# EAGLE board EEZ DIB DCP405 r4B2 (EAGLE 7.2.0), part 1 of 2
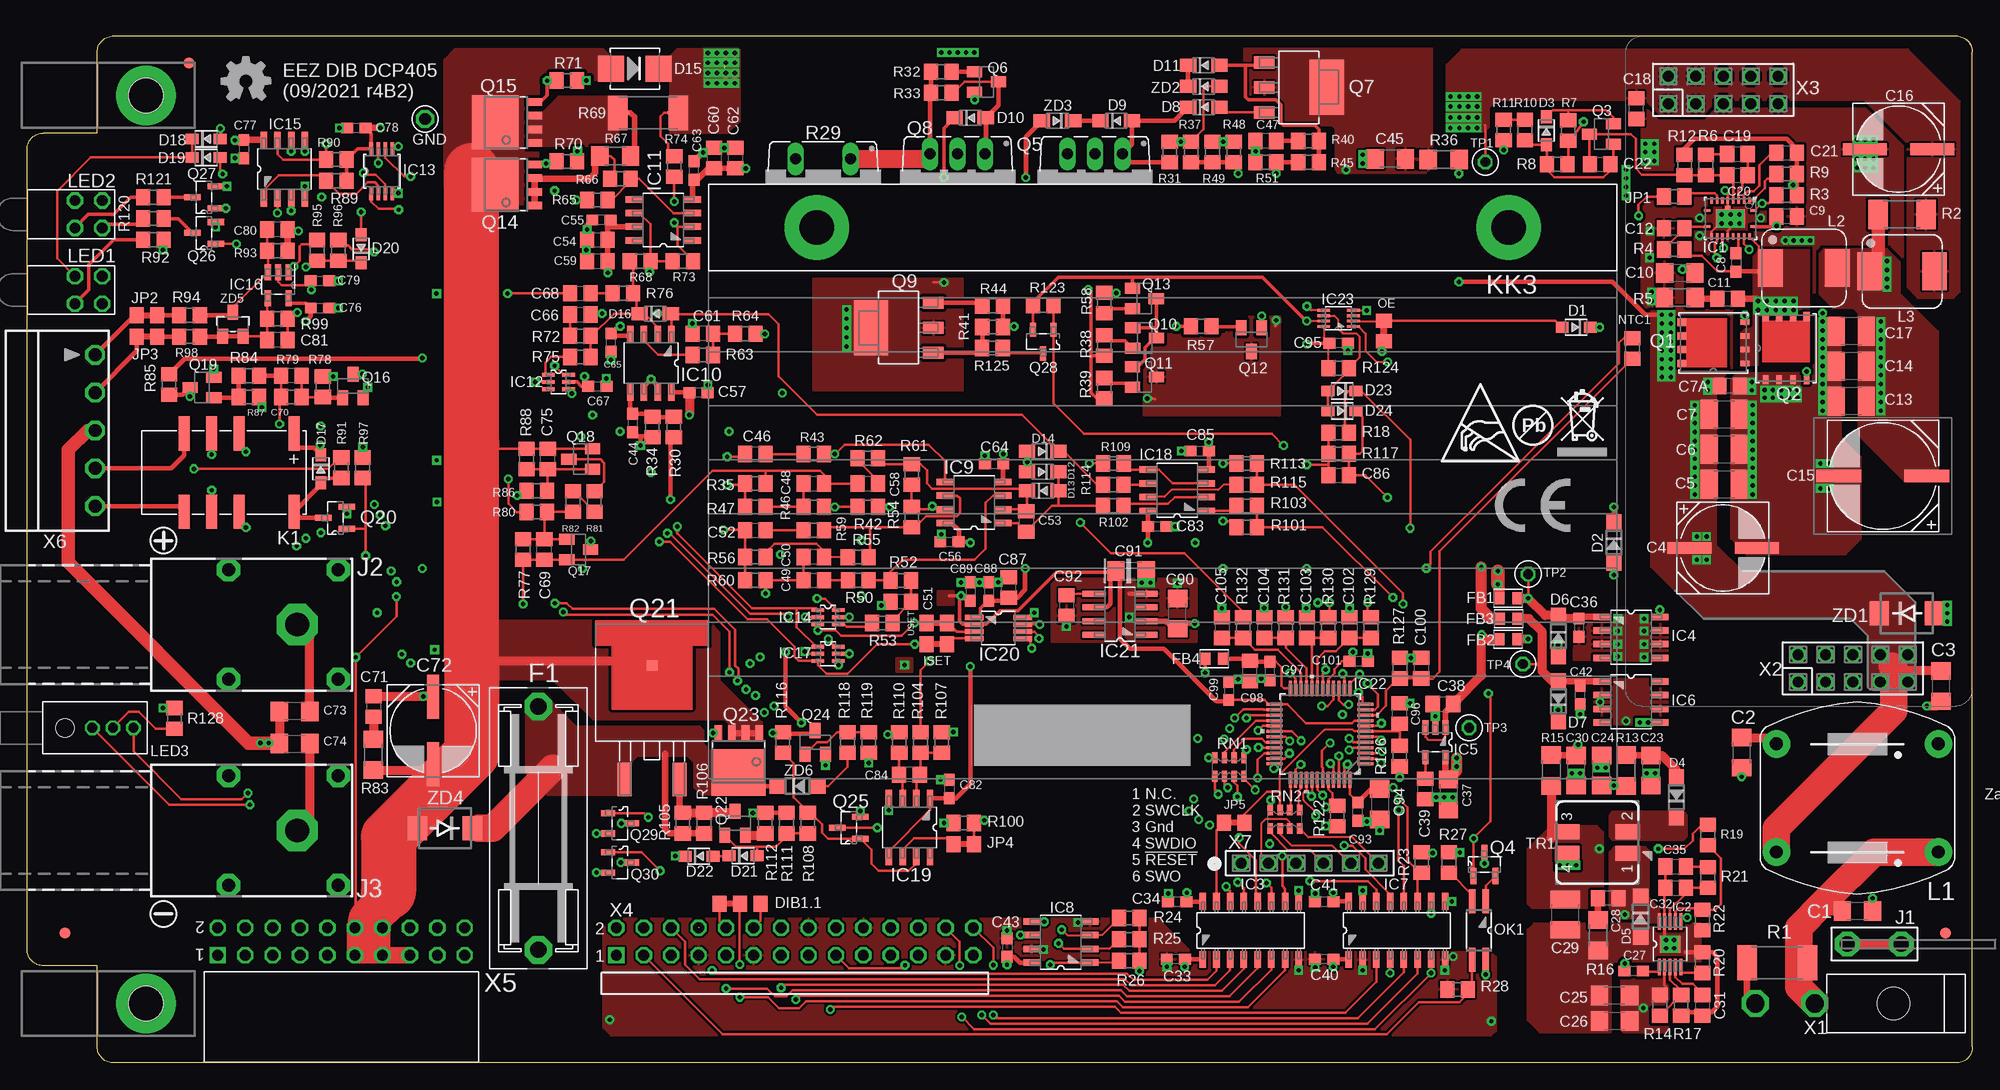
[diagram p6: board, top side]
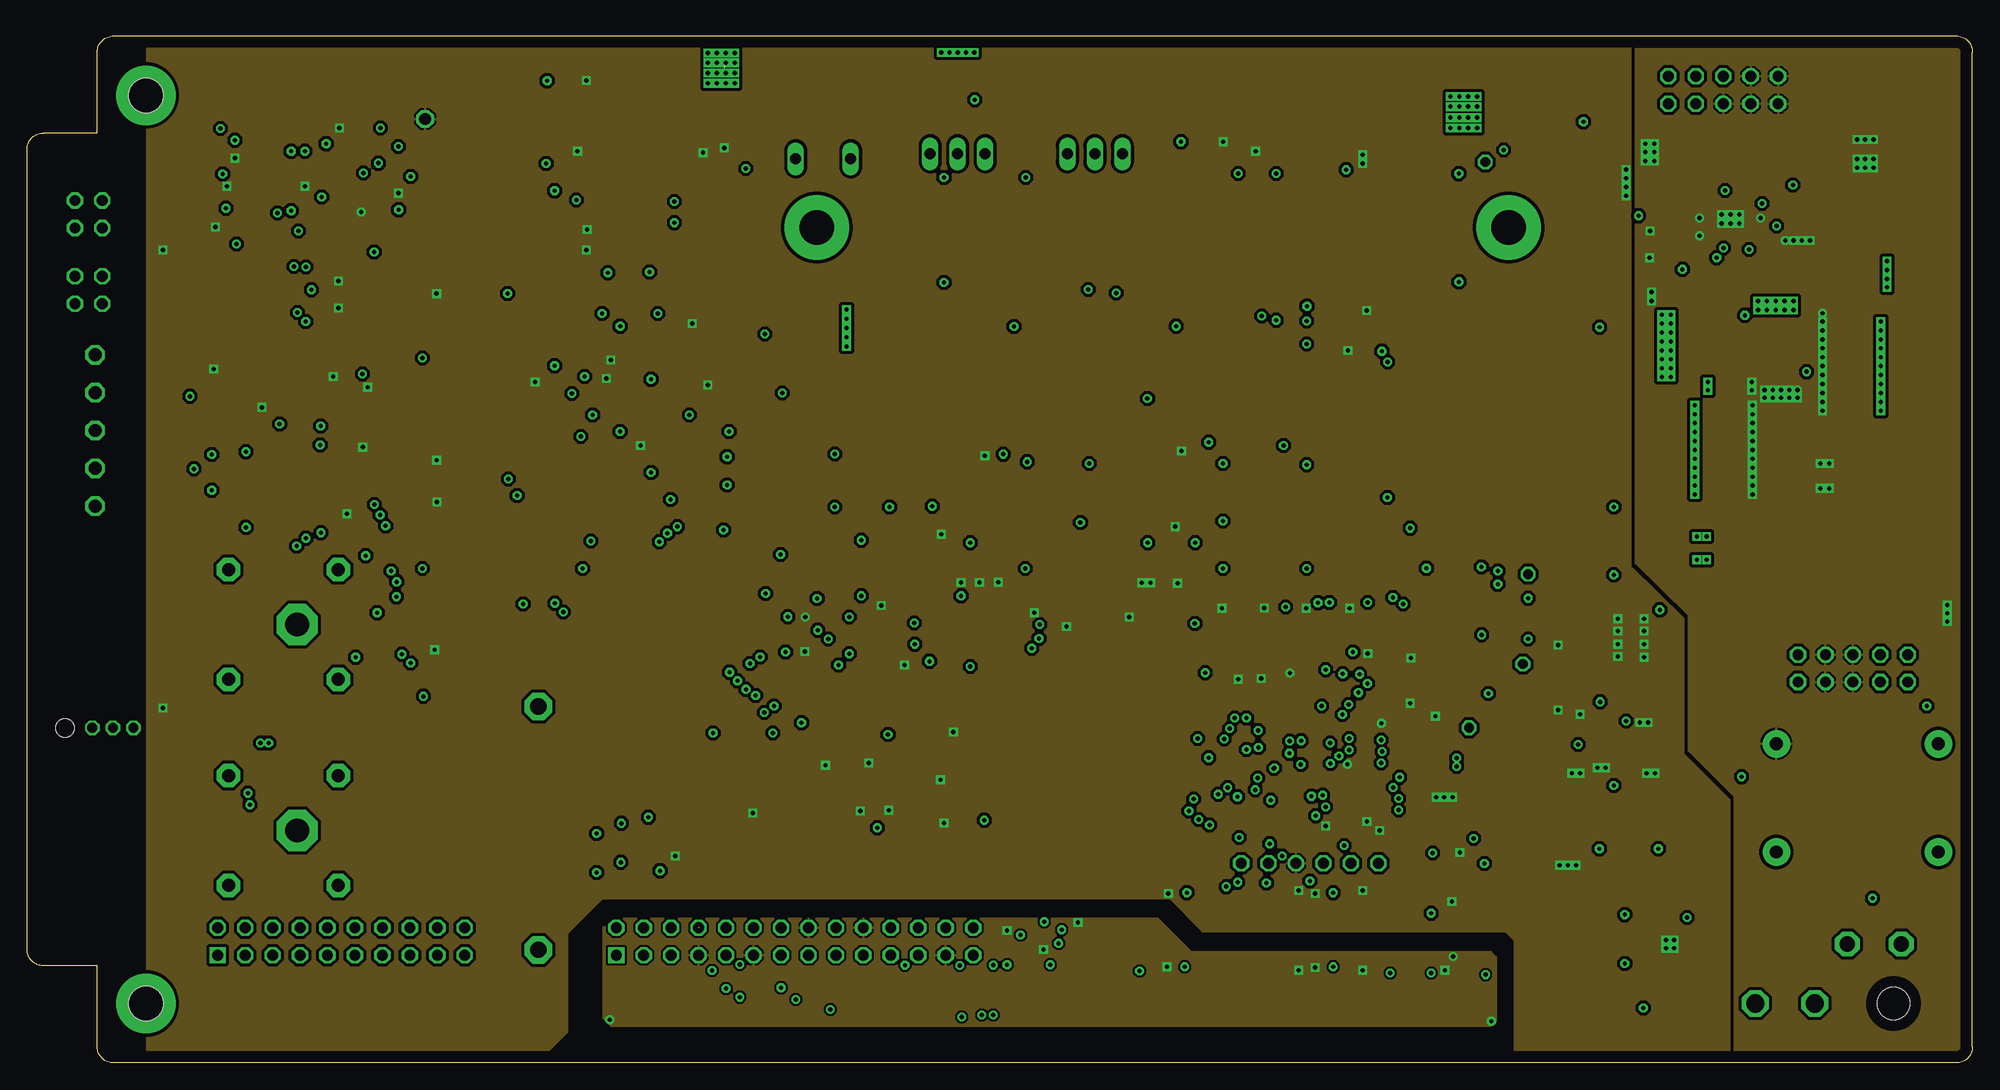
[diagram p7: board, inner layer L2]
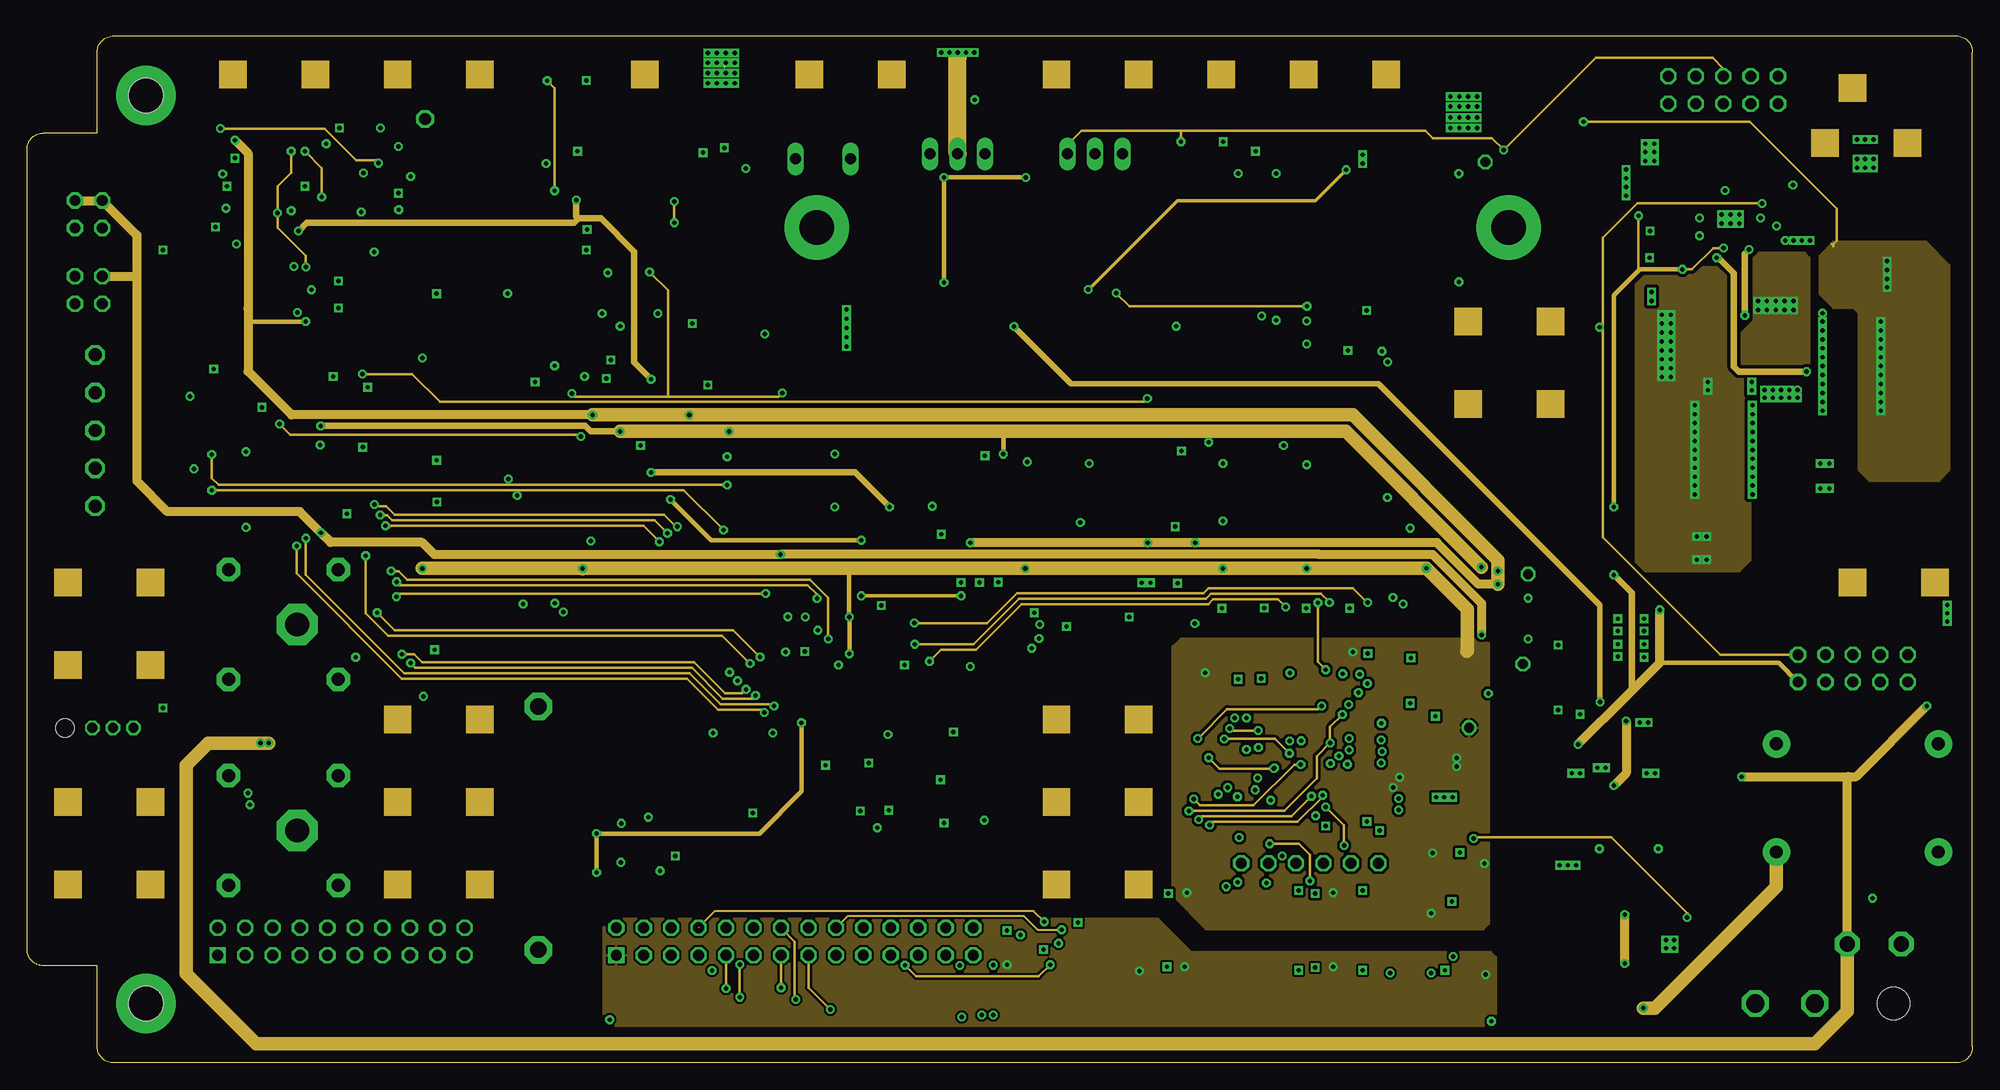
[diagram p8: board, inner layer L3]
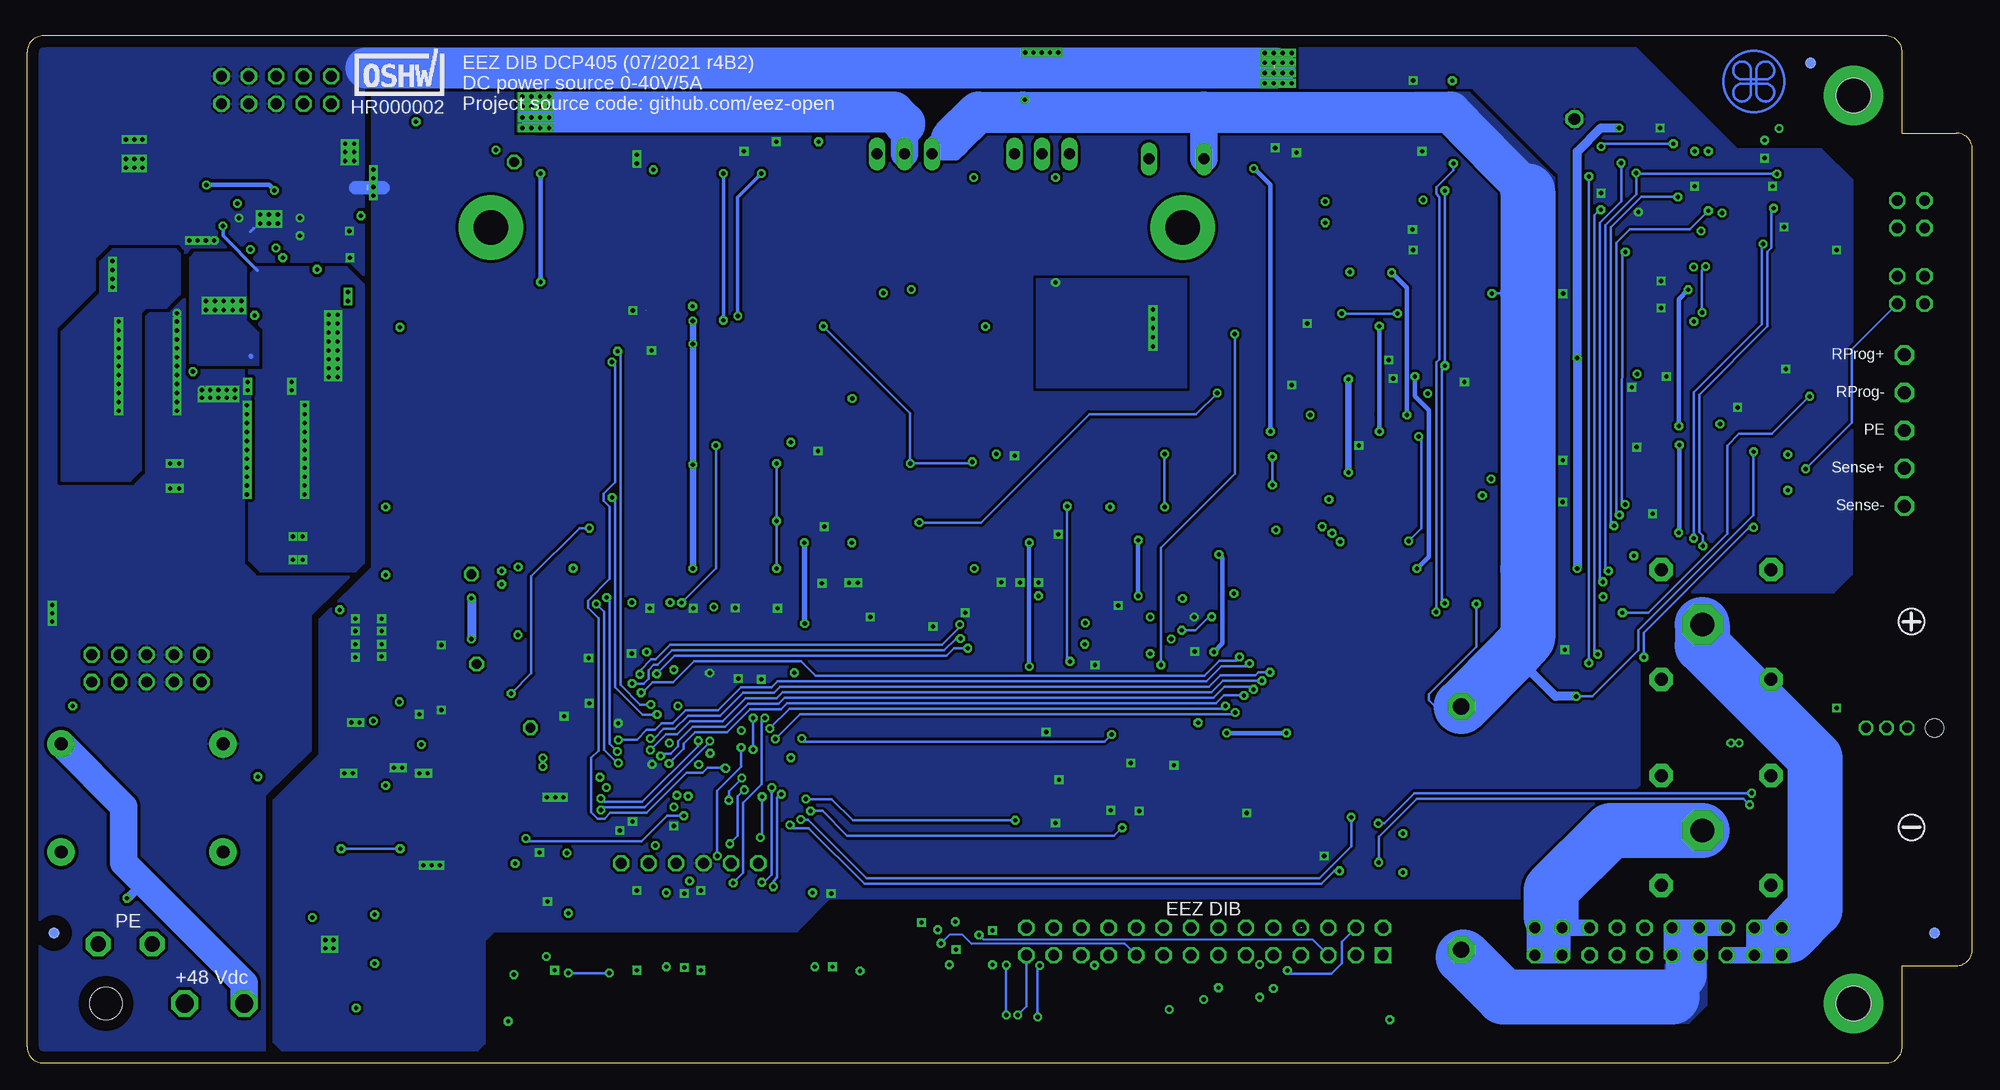
[diagram p9: board, bottom side, seen from below]

Size 180 x 95 mm. Coordinates in mm from the lower left corner, seen from the top.
Outline: 8,95 178.5,95 arc-90 180,93.5 180,1.5 arc-90 178.5,0 8,0 arc-90 6.5,1.5 6.5,9 1.5,9 arc-90 0,10.5 0,84.5 arc-90 1.5,86 6.5,86 6.5,93.5 arc-90 8,95
Copper layers (1+2+15+16): Top 0.035mm / dielectric 7mil / L2 0.03mm / dielectric 44mil / L3 0.03mm / dielectric 7mil / Bottom 0.035mm
Design rules "default *": minimum track width 6mil, minimum drill 0.3mm, track to track 6mil, track to pad 6mil, pad to pad 6mil, via to via 6mil, smd to smd 6mil, copper to edge 40mil, drill to drill 8mil, minimum pad ring 4mil, minimum via ring 8mil, stop-mask expansion 2.5mil, vias tented up to drill 1mm, thermal gap 8mil
Net classes: 0 default: width 0.203 mm, drill 0.3 mm, clearance 0.203 mm; 1 lvds: width 0.152 mm, drill 0.3 mm, clearance 0.152 mm to class 0, clearance 0.152 mm; 2 gnd: width 0.254 mm, drill 0.584 mm, clearance 0.254 mm
vRestrict: area 53,0 to 128,8.5; area 0,0 to 42,14

## Footprints (pad centres in the part's own frame; a part is rotated, then mirrored left to right if it is on the bottom)
C1206 = smd 1.6 x 1.8: 1 -1.4,0; 2 1.4,0
CAPAE830X1050N = smd 4.064 x 1.092: + -3.124,0; - 3.124,0
C1210 = smd 1.6 x 2.7: 1 -1.4,0; 2 1.4,0
C0805 = smd 1.3 x 1.5: 1 -0.95,0; 2 0.95,0
C0603 = smd 1.1 x 1: 1 -0.85,0; 2 0.85,0
CAPAE1030X1050N = smd 4.166 x 1.194: + -4.064,0; - 4.064,0
EC1206 = smd 1.6 x 1.8: + -1.4,0; - 1.4,0
SOD323-R = smd 1.2 x 1: A 1.3,0; C -1.3,0
SOD123 = smd 1.4 x 1.4: A 1.9,0; C -1.9,0
SOD323-W = smd 1.5 x 1.2: A 1.45,0; C -1.45,0
SMB = smd 2.4 x 2.4: A 2.2,0; C -2.2,0
JP3-0805-CUT2 = smd 1.3 x 1.5: COM 0,0; NC 1.9,0; NO -1.9,0
ZH32 = drill 1.5 pad 2.54 octagon: 1 -11.25,0; 2 11.25,0
BEAD0603 = smd 1 x 1.1: P$1 -0.85,0; P$2 0.85,0
FIDUCIAL_DUAL = smd 1.016 x 1.016 bottom: B 0,0 | smd 1.016 x 1.016: T 0,0
PCB_SHIELD_TAB = drill 1.1 octagon: 1 0,0
RGY0020B = smd 0.24 x 0.6: 1 -0.75,2.15; 10 -0.75,-2.15; 11 0.75,-2.15; 20 0.75,2.15 | smd 0.6 x 0.24: 2 -1.65,1.75; 3 -1.65,1.25; 4 -1.65,0.75; 5 -1.65,0.25; 6 -1.65,-0.25; 7 -1.65,-0.75; 8 -1.65,-1.25; 9 -1.65,-1.75; 12 1.65,-1.75; 13 1.65,-1.25; 14 1.65,-0.75; 15 1.65,-0.25; 16 1.65,0.25; 17 1.65,0.75; 18 1.65,1.25; 19 1.65,1.75 | smd 1.7 x 2.7: 21 0,0
SOP50P490X110-11N = smd 1.549 x 0.279: 1 -2.108,0.991; 2 -2.108,0.508; 3 -2.108,0; 4 -2.108,-0.508; 5 -2.108,-0.991; 6 2.108,-0.991; 7 2.108,-0.508; 8 2.108,0; 9 2.108,0.508; 10 2.108,0.991 | smd 1.575 x 1.88: TP 0,0
SOIC-16 = smd 1.549 x 0.61: 1 -2.692,4.445; 2 -2.692,3.175; 3 -2.692,1.905; 4 -2.692,0.635; 5 -2.692,-0.635; 6 -2.692,-1.905; 7 -2.692,-3.175; 8 -2.692,-4.445; 9 2.692,-4.445; 10 2.692,-3.175; 11 2.692,-1.905; 12 2.692,-0.635; 13 2.692,0.635; 14 2.692,1.905; 15 2.692,3.175; 16 2.692,4.445
SOIC127P600X173-8N = smd 1.55 x 0.6: 1 -2.7,1.9; 2 -2.7,0.63; 3 -2.7,-0.64; 4 -2.7,-1.91; 5 2.7,-1.91; 6 2.7,-0.64; 7 2.7,0.63; 8 2.7,1.9
SOT95P270X145-5N = smd 1.321 x 0.559: 1 -1.372,0.94; 2 -1.372,0; 3 -1.372,-0.94; 4 1.372,-0.94; 5 1.372,0.94
SOT65P210X110-6N = smd 1.168 x 0.356: 1 -0.94,0.66; 2 -0.94,0; 3 -0.94,-0.66; 4 0.94,-0.66; 5 0.94,0; 6 0.94,0.66
DCT8 = smd 1.232 x 0.356: 1 -2.064,0.975; 2 -2.064,0.325; 3 -2.064,-0.325; 4 -2.064,-0.975; 5 2.064,-0.975; 6 2.064,-0.325; 7 2.064,0.325; 8 2.064,0.975
DBV5 = smd 1.473 x 0.559: 1 -1.194,0.95; 2 -1.194,0; 3 -1.194,-0.95; 4 1.194,-0.95; 5 1.194,0.95
DGK8-M = smd 1.727 x 0.483: 1 -2.235,0.965; 2 -2.235,0.33; 3 -2.235,-0.33; 4 -2.235,-0.965; 5 2.235,-0.965; 6 2.235,-0.33; 7 2.235,0.33; 8 2.235,0.965
SOIC127P600X175-8N = smd 1.981 x 0.559: 1 -2.464,1.905; 2 -2.464,0.635; 3 -2.464,-0.635; 4 -2.464,-1.905; 5 2.464,-1.905; 6 2.464,-0.635; 7 2.464,0.635; 8 2.464,1.905
LQFP-48 = smd 1.473 x 0.279: 1 -4.216,2.743; 2 -4.216,2.261; 3 -4.216,1.753; 4 -4.216,1.245; 5 -4.216,0.762; 6 -4.216,0.254; 7 -4.216,-0.254; 8 -4.216,-0.762; 9 -4.216,-1.245; 10 -4.216,-1.753; 11 -4.216,-2.261; 12 -4.216,-2.743; 25 4.216,-2.743; 26 4.216,-2.261; 27 4.216,-1.753; 28 4.216,-1.245; 29 4.216,-0.762; 30 4.216,-0.254; 31 4.216,0.254; 32 4.216,0.762; 33 4.216,1.245; 34 4.216,1.753; 35 4.216,2.261; 36 4.216,2.743 | smd 0.279 x 1.473: 13 -2.743,-4.216; 14 -2.261,-4.216; 15 -1.753,-4.216; 16 -1.245,-4.216; 17 -0.762,-4.216; 18 -0.254,-4.216; 19 0.254,-4.216; 20 0.762,-4.216; 21 1.245,-4.216; 22 1.753,-4.216; 23 2.261,-4.216; 24 2.743,-4.216; 37 2.743,4.216; 38 2.261,4.216; 39 1.753,4.216; 40 1.245,4.216; 41 0.762,4.216; 42 0.254,4.216; 43 -0.254,4.216; 44 -0.762,4.216; 45 -1.245,4.216; 46 -1.753,4.216; 47 -2.261,4.216; 48 -2.743,4.216
DCU8 = smd 1.168 x 0.254: 1 -1.372,0.75; 2 -1.372,0.25; 3 -1.372,-0.25; 4 -1.372,-0.75; 5 1.372,-0.75; 6 1.372,-0.25; 7 1.372,0.25; 8 1.372,0.75
JP2-0805-NOCUT = smd 1.3 x 1.5: 1 -0.95,0; 2 0.95,0
PCB_TAB-4907 = drill 1.4 pad 2.3 octagon: 1 -2.5,0; 2 2.5,0
S16N-PC = drill 2.2 pad 3.81 octagon: 1 0,0 | drill 1.2 pad 2.184 octagon: NC1 -3.8,5.08; NC2 -3.8,-5.08; NC3 6.36,5.08; NC4 6.36,-5.08
R_0805 = smd 1.3 x 1.5: 1 -0.95,0; 2 0.95,0
FTR-C1 = smd 1 x 3.16: 1 -6.35,-3.62; 3 -1.27,-3.62; 4 1.27,-3.62; 5 3.81,-3.62; 8 3.81,3.62; 9 1.27,3.62; 10 -1.27,3.62; 12 -6.35,3.62
PCB-MB = hole 3.2: 0,0
SK96/84 = drill 3.2 pad 6: 1 10,4; 2 74,4
RN112 = drill 1.2 pad 2.54: 1 -7.5,5; 2 7.5,5; 3 -7.5,-5; 4 7.5,-5
PANASONIC_ETQ-P4_KFM = smd 2.3 x 3.5: 1 -3.1,0; 2 3.1,0
COILCRAFT_HPI0630 = smd 2.3 x 3.5: 1 -3,0; 2 3,0
WP934MD = drill 1 octagon: BA -1.27,1.27; BC -1.27,-1.27; TA 1.27,1.27; TC 1.27,-1.27
L-42WUM-1EGWT = drill 0.9 octagon: CC 4.445,0; GREEN 6.35,0; RED 2.54,0 | hole 1.7: 0,0
SO4 = smd 0.6 x 2.2: 1 -0.635,-2.7; 2 0.635,-2.7; 3 0.635,2.7; 4 -0.635,2.7
TDSON-8 = smd 0.838 x 0.508: 1 -2.913,1.905; 2 -2.913,0.635; 3 -2.913,-0.635; 4 -2.913,-1.905 | smd 0.813 x 0.61: 5 2.913,-1.905; 6 2.913,-0.635; 7 2.913,0.635; 8 2.913,1.905
SOT23-BEC = smd 1 x 1.4: B -0.95,-1.1; C 0,1.1; E 0.95,-1.1
SOT103P240X110-3N = smd 1.524 x 0.559: 1 -1.079,1.016; 2 -1.079,-1.016; 3 1.079,0
TO220FP-V = drill 1.016 long: 1 -2.54,-0.203; 2 0,-0.203; 3 2.54,-0.203
SOT230P700X180-4N = smd 1.905 x 1.143: 1 -3.2,2.311; 2 -3.2,0; 3 -3.2,-2.311 | smd 3.175 x 5.08: 4 2.565,0
SOT669 = smd 0.7 x 1.4: 1 -1.905,-2.65; 2 -0.635,-2.65; 3 0.635,-2.65; 4 1.905,-2.65 | smd 5 x 4.3: MB 0,1
D2PAK = smd 1.3 x 3.1: 1 -2.54,-10.528; 3 2.54,-10.528 | smd 1 x 1: 2 0,0
SOT95P237X112-3N = smd 1.321 x 0.559: 1 -1.092,0.94; 2 -1.092,-0.94; 3 1.092,0
R2512 = smd 1.8 x 3.2: 1 -2.8,0; 2 2.8,0
R2010 = smd 1.8 x 2.7: 1 -2.2,0; 2 2.2,0
R0805 = smd 1.3 x 1.5: 1 -0.95,0; 2 0.95,0
R1206 = smd 1.6 x 1.803: 1 -1.422,0; 2 1.422,0
TO220-2R = drill 1.016 long: 1 -2.54,0.254; 2 2.54,0.254
R_2512-4WIRE = smd 1.8 x 3.2: 1 -2.8,0; 2 2.8,0 | smd 1.27 x 0.254: 1S -2.413,0; 2S 2.413,0
CAY16 = smd 0.5 x 1: 1 -1.35,-0.85; 2 -0.45,-0.85; 3 0.45,-0.85; 4 1.35,-0.85; 5 1.35,0.85; 6 0.45,0.85; 7 -0.45,0.85; 8 -1.35,0.85
SHORT_NOHOLE = smd 0.5 x 0.25 bottom: 1 0,0.117; 2 0,-0.117
TEST-PIN_0.9MM = drill 0.9 octagon: 1 0,0
SRF0703 = smd 1.4 x 2.3: 1 1,2.8; 2 -1,2.8; 3 -1,-2.8; 4 1,-2.8
MINIFIT_39301020 = drill 1.7 octagon: 1 0,0; 2 0,5.5 | hole 3: 0,-7.3
SSW-105-02-S-D = drill 1 pad 1.5 octagon: 1 -5.08,-1.27; 2 -5.08,1.27; 3 -2.54,-1.27; 4 -2.54,1.27; 5 0,-1.27; 6 0,1.27; 7 2.54,-1.27; 8 2.54,1.27; 9 5.08,-1.27; 10 5.08,1.27
77317-104-28LF = drill 1 pad 1.5 square: 1 -33.02,-2.54 | drill 1 pad 1.5 octagon: 2 -33.02,0; 3 -30.48,-2.54; 4 -30.48,0; 5 -27.94,-2.54; 6 -27.94,0; 7 -25.4,-2.54; 8 -25.4,0; 9 -22.86,-2.54; 10 -22.86,0; 11 -20.32,-2.54; 12 -20.32,0; 13 -17.78,-2.54; 14 -17.78,0; 15 -15.24,-2.54; 16 -15.24,0; 17 -12.7,-2.54; 18 -12.7,0; 19 -10.16,-2.54; 20 -10.16,0; 21 -7.62,-2.54; 22 -7.62,0; 23 -5.08,-2.54; 24 -5.08,0; 25 -2.54,-2.54; 26 -2.54,0; 27 0,-2.54; 28 0,0
SSW-110-02-T-D-RA = drill 1 pad 1.5 square: 1 22.86,2.54 | drill 1 pad 1.5 octagon: 2 22.86,0; 3 20.32,2.54; 4 20.32,0; 5 17.78,2.54; 6 17.78,0; 7 15.24,2.54; 8 15.24,0; 9 12.7,2.54; 10 12.7,0; 11 10.16,2.54; 12 10.16,0; 13 7.62,2.54; 14 7.62,0; 15 5.08,2.54; 16 5.08,0; 17 2.54,2.54; 18 2.54,0; 19 0,2.54; 20 0,0
MC1,5/5-G-3,5 = drill 1.2 octagon: 1 -7,0; 2 -3.5,0; 3 0,0; 4 3.5,0; 5 7,0
SSW-106-02-S-S = drill 1 pad 1.5 octagon: 1 -6.35,0; 2 -3.81,0; 3 -1.27,0; 4 1.27,0; 5 3.81,0; 6 6.35,0
DO214AA = smd 1.8 x 2.2: A 2.55,0; C -2.55,0
SOT23 = smd 1 x 1.4: 1 -0.95,-1.1; 2 0.95,-1.1; 3 0,1.1

## Placement (x,y rotation side)
C1  10n/200V  [C1206]  169.35,14.03 180 top
C2  10n/200V  [C1206]  158.62,28.7 270 top
C3  10n/200V  [C1206]  177.1,34.86 90 top
C4  EEEFK1H470P  [CAPAE830X1050N]  156.91,47.62 0 top
C5  4u7/100V  [C1210]  157.04,53.53 0 top
C6  4u7/100V  [C1210]  157.04,56.77 0 top
C7  4u7/100V  [C1210]  157.04,60.01 0 top
C7A  470n  [C0805]  157.54,62.61 180 top
C8  100n  [C0603]  158.12,74.04 270 top
C9  470n  [C0805]  162.81,78.3 180 top
C10  2u2  [C1206]  152.91,73.09 0 top
C11  1n  [C0805]  157.35,70.68 180 top
C12  15p  [C0805]  152.4,77.22 180 top
C13  10u  [C1210]  168.78,61.21 180 top
C14  10u  [C1210]  168.78,64.45 180 top
C15  EEEFK1J101P  [CAPAE1030X1050N]  171.7,54.29 180 top
C16  EEEFK1H470P  [CAPAE830X1050N]  173.16,84.52 180 top
C17  10u  [C1210]  168.78,67.69 180 top
C18  1u  [C0805]  148.91,88.27 90 top
C19  10n  [C0805]  158.24,84.07 0 top
C20  150p  [C0805]  158.24,82.11 0 top
C21  10n  [C0805]  162.81,84.2 0 top
C22  470p  [C0805]  145.53,83.12 0 top
C23  4u7  [C1206]  150.24,27.05 270 top
C24  4u7  [C1206]  145.67,27.05 90 top
C25  2u2  [C1206]  146.88,6.22 180 top
C26  2u2  [C1206]  146.88,3.87 180 top
C27  100n  [C0603]  148.65,8.51 0 top
C28  330p  [C0805]  146.3,15.24 180 top
C29  22u  [C1210]  142.3,13.72 270 top
C30  4u7  [C1206]  143.32,27.05 270 top
C31  10n  [C0805]  155,5.33 270 top
C32  33p  [C0805]  152.53,16.19 0 top
C33  100n  [C0603]  106.3,9.59 180 top
C34  100n  [C0603]  106.43,14.92 0 top
C35  10n  [C0805]  152.53,18.16 0 top
C36  100n  [C0603]  143.57,40.26 270 top
C37  2u2  [C1206]  131.51,24.83 270 top
C38  N.C.  [C0805]  131,33.21 0 top
C39  10n  [C0805]  129.35,25.34 90 top
C40  100n  [C0603]  120.02,9.59 180 top
C41  100n  [C0603]  120.02,14.92 0 top
C42  100n  [C0603]  143.7,34.04 90 top
C43  100n  [C0603]  90.68,10.67 270 top
C44  100n  [C0603]  56.03,59.18 270 top
C45  1u/100V  [C1206]  126.12,83.62 180 top
C46  N.C.  [C0805]  67.38,56.32 0 top
C47  10n  [C0805]  114.62,85.28 180 top
C48  N.C.  [C0805]  72.78,53.59 0 top
C49  150p  [C0805]  72.78,44.64 0 top
C50  N.C.  [C0805]  72.78,46.8 180 top
C51  2n2  [C0805]  80.86,42.66 180 top
C52  N.C.  [C0805]  67.38,49.28 0 top
C53  100p  [C0805]  92.44,50.09 270 top
C54  10n  [C0805]  52.77,76.14 0 top
C55  100n  [C0603]  53.16,77.98 180 top
C56  100n  [C0603]  85.35,48.21 0 top
C57  100n  [C0603]  62.13,61.99 180 top
C58  150p  [C0805]  77.79,53.59 0 top
C59  1u  [C0805]  52.77,74.17 0 top
C60  10n  [C0805]  63.56,83.7 270 top
C61  2n2  [C0805]  62.52,67.46 180 top
C62  1u  [C0805]  65.53,83.7 270 top
C63  100n  [C0603]  61.72,82.56 90 top
C64  100n  [C0603]  89.48,55.44 0 top
C65  100n  [C0603]  54.05,66.62 90 top
C66  4n7  [C0805]  51.2,69.23 0 top
C67  100n  [C0603]  52.77,62.6 0 top
C68  6n8  [C0805]  51.2,71.2 0 top
C69  10n  [C0805]  47.87,47.5 90 top
C70  2n2  [C0805]  24.45,63.56 180 top
C71  470n  [C0805]  32.07,32.96 270 top
C72  HHXC630A330MHA0  [CAPAE830X1050N]  37.58,30.73 270 top
C73  10n/200V  [C1206]  24.77,32.51 180 top
C74  10n/200V  [C1206]  24.77,29.53 0 top
C75  10n  [C0805]  48.18,55.85 90 top
C76  100n  [C0603]  27.11,69.82 0 top
C77  100n  [C0603]  20.07,84.52 270 top
C78  100n  [C0603]  30.48,86.49 0 top
C79  100n  [C0603]  27.1,72.34 0 top
C80  100p  [C0805]  23.18,77.09 180 top
C81  100p  [C0805]  23.18,66.87 180 top
C82  100n  [C0603]  85.33,25.34 270 top
C83  100n  [C0603]  104.55,49.61 180 top
C84  4n7  [C0805]  81.65,26.67 180 top
C85  100n  [C0603]  108.49,56.6 0 top
C86  4n7  [C0805]  121.35,54.37 0 top
C87  1u  [C0805]  90.83,43.98 90 top
C88  100n  [C0603]  88.99,43.6 270 top
C89  100n  [C0603]  87.27,43.6 270 top
C90  4u7  [C1206]  106.46,41.57 90 top
C91  4u7 tant.  [EC1206]  102.15,45.5 0 top
C92  1u  [C0805]  96.18,42.33 270 top
C93  100n  [C0603]  123.13,23.24 90 top
C94  4u7  [C1206]  125.16,23.93 270 top
C95  100n  [C0603]  121.35,66.57 180 top
C96  1n  [C0805]  127,32.32 90 top
C97  100n  [C0603]  115,36.26 90 top
C98  1u  [C0805]  113.16,36.26 90 top
C99  100n  [C0603]  111.19,34.42 270 top
C100  10n  [C0805]  128.98,36.51 270 top
C101  100n  [C0603]  123.2,37.15 180 top
C102  4n7  [C0805]  122.36,40.26 270 top
C103  4n7  [C0805]  118.43,40.26 270 top
C104  4n7  [C0805]  114.49,40.26 270 top
C105  4n7  [C0805]  110.55,40.26 270 top
D1  BAS316  [SOD323-R]  143.33,68.05 180 top
D2  SKL16  [SOD123]  146.81,48.13 270 top
D3  BAS316  [SOD323-R]  140.56,86.23 270 top
D4  SKL16  [SOD123]  152.59,24.57 90 top
D5  SKL16  [SOD123]  149.29,13.53 270 top
D6  SKL14  [SOD123]  141.67,39.5 270 top
D7  SKL14  [SOD123]  141.67,33.46 90 top
D8  BAS316  [SOD323-W]  108.88,88.42 0 top
D9  BAS316  [SOD323-W]  100.77,87.14 0 top
D10  BAS316  [SOD323-W]  87.26,87.42 0 top
D11  BAS316  [SOD323-W]  108.88,92.29 0 top
D12  BAS316  [SOD323-W]  93.98,54.67 180 top
D13  BAS316  [SOD323-W]  93.98,52.92 0 top
D14  BAS316  [SOD323-W]  93.98,56.57 180 top
D15  SK55  [SMB]  56.24,91.97 180 top
D16  BAS316  [SOD323-W]  58.12,69.3 0 top
D17  BAS316  [SOD323-R]  27.19,54.96 270 top
D18  BAS316  [SOD323-R]  16.57,85.47 0 top
D19  BAS316  [SOD323-R]  16.57,83.76 0 top
D20  BAS316  [SOD323-R]  30.91,75.3 90 top
D21  BAS316  [SOD323-R]  66.26,19.15 0 top
D22  BAS316  [SOD323-R]  62.17,19.13 0 top
D23  BAS316  [SOD323-R]  121.67,62.15 180 top
D24  BAS316  [SOD323-R]  121.67,60.31 180 top
DIB1.1  JP3-CUT-0805-ROTATED  [JP3-0805-CUT2]  65.98,14.73 180 top
EEZ_SIGNATURE  SIGNATURESMALL  [SIGNATURE_5MM]  20.24,90.78 180 top
F1  ZH32  [ZH32]  47.31,21.72 270 top
FB1  60R@100MHz  [BEAD0603]  137.06,42.99 180 top
FB2  60R@100MHz  [BEAD0603]  137.06,39.2 180 top
FB3  60R@100MHz  [BEAD0603]  137.07,41.1 180 top
FB4  60R@100MHz  [BEAD0603]  109.86,37.4 0 top
FM1  FIDUCIAL_2  [FIDUCIAL_DUAL]  15,92.5 0 top
FM2  FIDUCIAL_2  [FIDUCIAL_DUAL]  177.5,12 0 top
FM3  FIDUCIAL_2  [FIDUCIAL_DUAL]  3.5,12 0 top
GND  [PCB_SHIELD_TAB]  36.83,87.31 0 top
IC1  LM5145RGYT  [RGY0020B]  157.61,78.11 270 top
IC2  TPS54060DGQ  [SOP50P490X110-11N]  152.02,10.99 90 top
IC3  Si8662AB-B-IS1  [SOIC-16]  113.22,12.26 90 top
IC4  MC78L05  [SOIC127P600X173-8N]  148.4,39.37 0 top
IC5  LP2985-33DBVR  [SOT95P270X145-5N]  130.3,29.65 270 top
IC6  MC79L05  [SOIC127P600X173-8N]  148.4,33.4 0 top
IC7  Si8641AB-B-IS1  [SOIC-16]  126.75,12.26 90 top
IC8  M24C32-WMN6P  [SOIC127P600X173-8N]  95.66,11.18 180 top
IC9  TL072D  [SOIC127P600X173-8N]  87.62,51.84 180 top
IC10  TL072D  [SOIC127P600X173-8N]  57.73,64.73 270 top
IC11  LTC2050HVCS8#PBF  [SOIC127P600X173-8N]  58.87,77.98 180 top
IC12  SN74LVC1G3157DCKR  [SOT65P210X110-6N]  49.17,62.99 0 top
IC13  SN74LVC2G08DCTR  [DCT8]  32.83,82.49 90 top
IC14  SN74LVC1G3157DCKR  [SOT65P210X110-6N]  74.1,41.24 0 top
IC15  LM293D  [SOIC127P600X173-8N]  23.81,82.68 90 top
IC16  OPA202IDBV  [DBV5]  23.24,71.95 270 top
IC17  SN74LVC1G3157DCKR  [SOT65P210X110-6N]  74.12,37.85 0 top
IC18  LM293D  [SOIC127P600X173-8N]  106.41,52.97 180 top
IC19  MAX9141ESA  [SOIC127P600X173-8N]  81.65,21.78 270 top
IC20  DAC8552IDGKR  [DGK8-M]  89.88,40.23 0 top
IC21  REF5025AIDR  [SOIC127P600X175-8N]  101.13,41.5 180 top
IC22  STM32F373C8T6  [LQFP-48]  119.63,30.42 180 top
IC23  74AUP1G74DC.125  [DCU8]  121.35,68.87 180 top
ISET  JP2-NOCUT-0805  [JP2-0805-NOCUT]  84.19,38.73 180 top
J1  4907  [PCB_TAB-4907]  170.92,11 180 top
J2  FCR7350R  [S16N-PC]  25,40.55 180 top
J3  FCR7350B  [S16N-PC]  25,21.5 180 top
JP1  JP2-CUT-0805  [R_0805]  152.4,80.14 0 top
JP2  JP2-NOCUT-0805  [JP2-0805-NOCUT]  11.11,69.15 0 top
JP3  JP2-NOCUT-0805  [JP2-0805-NOCUT]  11.11,67.18 0 top
JP4  JP2-NOCUT-0805  [JP2-0805-NOCUT]  86.66,20.23 180 top
JP5  JP2-NOCUT-0805  [JP2-0805-NOCUT]  111.7,22.23 0 top
K1  FTR-C1GA005G-B05  [FTR-C1]  18.36,54.61 180 top
KK1  PMB-1  [PCB-MB]  11,89.5 0 top
KK2  PMB-1  [PCB-MB]  11,5.5 0 top
KK3  SK96/84  [SK96/84]  147.08,81.28 180 top
L1  RN112-4-02-0M7  [RN112]  169.35,24.51 180 top
L2  ETQ-P4M100KFM  [PANASONIC_ETQ-P4_KFM]  164.4,73.53 0 top
L3  HPI0630-3R3  [COILCRAFT_HPI0630]  173.48,73.22 0 top
LED1  WP934MD/2LID  [WP934MD]  5.7,71.5 0 top
LED2  WP934MD/LYLID  [WP934MD]  5.7,78.5 0 top
LED3  WP42WUM/EGW  [L-42WUM-1EGWT]  3.5,31 0 top
NTC1  NTCS0805E3103JMT  [R_0805]  148.53,66.1 270 top
OE  JP2-NOCUT-0805  [JP2-0805-NOCUT]  125.54,67.7 90 top
OK1  TLP291-GB.SE-T  [SO4]  134.33,12.26 180 top
OSHWA  HR000002  [CERT-SMALL-SILK]  145.55,89.45 0 bottom
Q1  BSC117N08NS5ATMA1  [TDSON-8]  156.02,66.61 180 top
Q2  BSC039N06NSATMA1  [TDSON-8]  162.75,66.1 90 top
Q3  MMBT5401  [SOT23-BEC]  145.66,85.92 90 top
Q4  2N7002  [SOT103P240X110-3N]  134.84,18.35 90 top
Q5  FQPF33N10  [TO220FP-V]  98.81,83.88 180 top
Q6  BC857C  [SOT23-BEC]  88.77,90.75 270 top
Q7  BCP56-16.115  [SOT230P700X180-4N]  117.67,90.23 0 top
Q8  FQPF11P06 or FQPF27P06  [TO220FP-V]  86.11,83.88 180 top
Q9  BCP56-16.115  [SOT230P700X180-4N]  80.65,68.01 180 top
Q10  MMBT5401  [SOT23-BEC]  103.4,67.06 270 top
Q11  MMBT5401  [SOT23-BEC]  103.38,63.45 270 top
Q12  MMBT5551  [SOT23-BEC]  113.28,66.91 180 top
Q13  MMBT5551  [SOT23-BEC]  103.38,70.7 270 top
Q14  PSMN0R9-25YLC  [SOT669]  44.32,81.22 90 top
Q15  PSMN0R9-25YLC  [SOT669]  44.32,87 90 top
Q16  MMBT5551  [SOT23-BEC]  30.16,62.62 0 top
Q17  MMBT5401  [SOT23-BEC]  51.04,47.5 270 top
Q18  MMBT5551  [SOT23-BEC]  51.23,55.85 90 top
Q19  MMBT5551  [SOT23-BEC]  16.19,62.48 90 top
Q20  2N7002  [SOT103P240X110-3N]  28.52,50.42 180 top
Q21  BT139B-600E  [D2PAK]  57.82,36.77 0 top
Q22  FMMT493TA  [SOT23-BEC]  65.51,22.17 0 top
Q23  PSMN013-60YL  [SOT669]  65.85,27.86 180 top
Q24  MMBT5551  [SOT23-BEC]  72.92,29.65 0 top
Q25  2N7002  [SOT103P240X110-3N]  76.03,21.76 180 top
Q26  2N7002  [SOT103P240X110-3N]  16.38,76.77 180 top
Q27  2N7002  [SOT103P240X110-3N]  16.38,80.07 180 top
Q28  IRLML2246TRPBF  [SOT95P237X112-3N]  94.01,66.73 270 top
Q29  IRLML2246TRPBF  [SOT95P237X112-3N]  54.86,22.16 0 top
Q30  IRLML2246TRPBF  [SOT95P237X112-3N]  54.86,18.54 0 top
R1  N.C.  [R2512]  161.93,9.27 0 top
R2  15R  [R2010]  173.48,78.49 180 top
R3  10K  [R0805]  162.81,80.26 180 top
R4  470R  [R0805]  152.4,75.25 0 top
R5  10R  [R1206]  152.91,70.8 0 top
R6  10K  [R0805]  155.32,83.06 270 top
R7  10K  [R0805]  142.6,86.23 90 top
R8  100K  [R0805]  141.58,83.12 180 top
R9  47K  [R0805]  162.81,82.23 180 top
R10  10K  [R0805]  138.6,86.3 90 top
R11  1K  [R0805]  136.63,86.3 270 top
R12  3K9  [R0805]  153.35,83.06 90 top
R13  10R  [R1206]  147.96,27.05 90 top
R14  47K  [R0805]  151.07,5.33 90 top
R15  10R  [R1206]  141.03,27.05 270 top
R16  10R  [R1206]  145.35,11.81 90 top
R17  2K2  [R0805]  153.03,5.33 90 top
R18  10K  [R0805]  121.35,58.29 0 top
R19  86K6  [R0805]  155.51,21.08 90 top
R20  330K  [R0805]  155,9.27 270 top
R21  86K6  [R0805]  155.51,17.14 270 top
R22  8K2  [R0805]  155,13.21 90 top
R23  10K  [R0805]  129.04,18.53 90 top
R24  10K  [R0805]  101.98,13.4 180 top
R25  10K  [R0805]  101.98,11.43 180 top
R26  10K  [R0805]  101.98,9.46 180 top
R27  100R  [R0805]  131.55,18.53 270 top
R28  4K7  [R0805]  132.35,6.79 0 top
R29  PWR220T-35-2R20J  [TO220-2R]  73.66,83.88 180 top
R30  10K  [R0805]  59.84,58.82 90 top
R31  1K  [R0805]  105.73,84.26 90 top
R32  2K2  [R0805]  84.58,91.69 0 top
R33  2K2  [R0805]  84.58,89.73 0 top
R34  220R  [R0805]  57.87,58.81 270 top
R35  N.C.  [R0805]  67.38,53.59 180 top
R36  10R  [R1206]  131.07,83.57 180 top
R37  16K  [R0805]  107.7,84.26 90 top
R38  220R  [R0805]  99.67,66.34 270 top
R39  220R  [R0805]  99.67,62.41 270 top
R40  47K  [R0805]  118.56,85.28 0 top
R41  1K  [R0805]  89.33,68.08 0 top
R42  7K5 0.1%  [R0805]  77.79,51.44 180 top
R43  N.C.  [R0805]  72.78,56.32 0 top
R44  220R  [R0805]  89.33,70.05 0 top
R45  100R  [R0805]  118.56,83.31 180 top
R46  100K 0.1%  [R0805]  72.78,51.44 180 top
R47  24K 0.1%  [R0805]  67.38,51.44 180 top
R48  2K2  [R0805]  111.64,84.26 270 top
R49  750R  [R0805]  109.67,84.26 270 top
R50  6K2  [R0805]  76.9,44.64 0 top
R51  51K  [R0805]  114.62,83.31 0 top
R52  10K  [R0805]  80.86,44.63 180 top
R53  2K2  [R0805]  79.12,40.68 0 top
R54  7K5 0.1%  [R0805]  81.86,50.48 270 top
R55  100K 0.1%  [R0805]  76.89,46.79 180 top
R56  24K 0.1%  [R0805]  67.38,46.8 180 top
R57  470R  [R0805]  108.65,68.14 0 top
R58  1K2  [R0805]  99.67,70.28 270 top
R59  N.C.  [R0805]  72.78,49.28 0 top
R60  N.C.  [R0805]  67.38,44.64 0 top
R61  10K  [R0805]  81.86,54.42 90 top
R62  1K  [R0805]  77.79,55.94 0 top
R63  2K2  [R0805]  62.52,65.49 180 top
R64  2K2  [R0805]  66.46,67.45 180 top
R65  36K 0.1%  [R0805]  52.77,79.82 0 top
R66  750R 0.1%  [R0805]  54.91,81.79 0 top
R67  1R  [R1206]  54.42,83.88 180 top
R68  6K2  [R0805]  56.72,74.16 180 top
R69  0R010  [R_2512-4WIRE]  57.47,87.88 180 top
R70  47K  [R0805]  49.96,83.39 180 top
R71  47K  [R0805]  49.96,90.88 180 top
R72  470R  [R0805]  51.19,67.25 0 top
R73  36K 0.1%  [R0805]  60.67,74.16 180 top
R74  750R 0.1%  [R0805]  59.89,82.93 270 top
R75  3K  [R0805]  51.19,65.29 0 top
R76  1K  [R0805]  55.14,71.2 0 top
R77  330R  [R0805]  45.9,47.5 270 top
R78  47K  [R0805]  27.37,62.55 270 top
R79  47K  [R0805]  24.45,61.59 0 top
R80  750R  [R0805]  47.17,50.96 0 top
R81  1K  [R0805]  52.5,51.92 270 top
R82  2K2  [R0805]  50.53,51.92 270 top
R83  1R  [R1206]  32.07,28.51 90 top
R84  10K  [R0805]  20.52,63.56 0 top
R85  10K  [R0805]  13.14,62.74 90 top
R86  750R  [R0805]  47.17,52.93 180 top
R87  47K  [R0805]  20.52,61.59 180 top
R88  330R  [R0805]  46.22,55.85 270 top
R89  4K7  [R0805]  28.64,81.6 180 top
R90  4K7  [R0805]  28.64,83.57 180 top
R91  470R  [R0805]  29.1,55.05 90 top
R92  470R  [R0805]  11.68,76.14 180 top
R93  10K  [R0805]  23.18,75.12 180 top
R94  10K  [R0805]  15.05,69.15 180 top
R95  1K  [R0805]  26.85,75.17 90 top
R96  1K  [R0805]  28.82,75.17 270 top
R97  100K  [R0805]  31.06,55.05 270 top
R98  10K  [R0805]  15.05,67.18 180 top
R99  10K  [R0805]  23.18,68.83 180 top
R100  10K  [R0805]  86.66,22.19 0 top
R101  3K9  [R0805]  112.86,49.56 180 top
R102  10K  [R0805]  100.51,51.53 0 top
R103  6K2  [R0805]  112.86,51.52 0 top
R104  330R  [R0805]  82.66,29.65 270 top
R105  1K  [R0805]  60.68,22.17 270 top
R106  1K  [R0805]  62.65,22.17 270 top
R107  10K  [R0805]  84.63,29.65 90 top
R108  1K  [R0805]  72.24,22.17 90 top
R109  10K  [R0805]  100.52,55.45 180 top
R110  10K  [R0805]  80.7,29.65 270 top
R111  100K  [R0805]  70.27,22.17 270 top
R112  6R2  [R0805]  68.3,22.17 270 top
R113  3K9  [R0805]  112.86,55.45 180 top
R114  10K  [R0805]  100.51,53.48 0 top
R115  6K2  [R0805]  112.86,53.49 0 top
R116  1K  [R0805]  69.94,29.65 270 top
R117  4K7  [R0805]  121.35,56.34 0 top
R118  22K  [R0805]  75.91,29.65 270 top
R119  22K  [R0805]  77.88,29.65 90 top
R120  330R  [R0805]  11.68,78.11 0 top
R121  330R  [R0805]  11.68,80.07 180 top
R122  10K  [R0805]  121.22,22.86 90 top
R123  100K  [R0805]  94.02,70.09 0 top
R124  10K  [R0805]  121.35,64.25 0 top
R125  10K  [R0805]  89.33,66.13 0 top
R126  10K  [R0805]  127,28.37 90 top
R127  3K3  [R0805]  127.01,36.51 90 top
R128  270R  [R0805]  13.64,31.88 90 top
R129  2K2  [R0805]  124.33,40.26 90 top
R130  2K2  [R0805]  120.4,40.26 90 top
R131  2K2  [R0805]  116.46,40.26 90 top
R132  2K2  [R0805]  112.52,40.26 90 top
RN1  DR1206-33R-4/8  [CAY16]  111.24,27.38 0 top
RN2  N.C.  [CAY16]  116.38,22.54 180 top
SH1  [SHORT_NOHOLE]  148.34,80.96 270 top
SH2  [SHORT_NOHOLE]  157.35,79.06 0 bottom
TP1  [TEST-PIN_0.9MM]  134.92,83.32 0 top
TP2  [TEST-PIN_0.9MM]  138.89,45.21 0 top
TP3  [TEST-PIN_0.9MM]  133.43,31 180 top
TP4  [TEST-PIN_0.9MM]  138.4,36.89 0 top
TR1  SRF0703-821M  [SRF0703]  145.29,20.38 270 top
U$1  [RECYCLE_BIN1/8]  141.61,56.13 0 top
U$2  [CE_5MM]  135.79,49.06 0 top
U$6  [ESD_SYMBOL]  130.9,55.65 0 top
U$7  [PB_SMALL]  139.32,58.99 0 top
USET  JP2-NOCUT-0805  [JP2-0805-NOCUT]  84.19,40.69 180 top
X1  39-30-1020  [MINIFIT_39301020]  165.41,5.5 90 top
X2  N.C.  [SSW-105-02-S-D]  168.94,36.5 0 top
X3  N.C.  [SSW-105-02-S-D]  156.94,90 0 top
X4  77317-104-28LF  [77317-104-28LF]  87.54,12.5 0 top
X5  DS1024-2*10R0  [SSW-110-02-T-D-RA]  40.5,12.5 180 top
X6  691322110005  [MC1,5/5-G-3,5]  6.3,58.5 270 top
X7  N.C.  [SSW-106-02-S-S]  118.68,18.48 0 top
ZD1  SMAJ51A  [DO214AA]  173.93,41.59 0 top
ZD2  BZX384-C15  [SOD323-W]  108.88,90.32 0 top
ZD3  PDZ6.2B  [SOD323-W]  95.34,87.14 180 top
ZD4  SMAJ51A  [DO214AA]  38.67,21.72 180 top
ZD5  SLVU2.8-TP  [SOT23]  19.05,68.33 0 top
ZD6  MMSZ5230BT1G  [SOD123]  71.3,25.62 0 top

## Tracks (layer width: path | path; a pad name or v marks a point on that pad's centre or on a via)
!DP_DRIVE
  Top 0.406: R41.1 R125.1 87.94,65.7 Q9.1
!OVP_FAULT  (via drill 0.4)
  Top 0.254: v120.56,29.6 119.83,28.87 119.83,27.38 119.89,27.32 IC22.43 | Q25.3 v78.68,21.75 | v125.87,52.31 123.81,54.37 C86.2 R117.2 123.3,56.34 123.55,56.58 123.55,59.73 D24.C
  L3 0.254: v120.56,29.6 120.56,31.08 v121.7,32.22 | 120.56,29.57 v120.56,29.6 | v107.5,23.3 107.52,23.32 116.32,23.32 119.34,26.34 119.34,28.38 v120.56,29.6
  Bottom 0.254: v121.7,32.22 123.05,32.22 125.59,34.76 125.59,52.03 v125.87,52.31 | v107.5,23.3 106.41,23.3 104.13,21.02 79.41,21.02 v78.68,21.75
!RESET
  Top 0.254: IC3.15 110.05,21.52 JP5.1
!SET_DP  (via drill 0.4)
  Top 0.254: IC22.18 119.89,36.09 v120.17,36.37 | R123.2 94.95,70.07 Q28.1 94.95,61.03 97.78,58.2 115.16,58.2 v116.26,57.11
  L3 0.254: v120.17,36.37 119.43,37.11 v119.43,42.57
  Bottom 0.254: v116.26,57.11 116.26,45.74 v119.43,42.57
+3V3  (via drill 0.4)  (1 unrouted)
  Top 0.203: IC23.8 119.98,67.09 C95.2 120.4,66.47 R124.1 | IC23.7 v118.39,68.62
  Top 0.254: 122.96,23.92 C93.2 122.38,24.84 IC22.48 | IC22.17 120.4,35.5 120.95,36.04 120.95,36.44 121.67,37.15 C101.2 122.35,37.69 v122.67,38.01 | 120.4,55.35 R117.1 R18.1 | 120.4,55.35 C86.1 | v118.39,55.33 120.39,55.33 120.4,55.35 | NTC1.1 148.53,67.14 147.81,67.14 147.27,66.6 147.27,64.71 129.84,47.28 129.84,46.13 v129.48,45.76 | v110.66,50.13 111.34,50.13 R101.2 | R113.2 v110.66,55.45 | R123.1 Q28.2 | IC17.5 v76.09,37.85 | R126.1 v127,26.43 | R23.2 129.04,19.43 v130.06,19.43 | Q4.3 v134.84,18.45
  Top 0.305: FB4.P$1 v109.02,36.09 | C78.2 31.86,85.96 IC13.8 30.57,84.55 R90.1 R89.1 | IC14.5 v76.07,41.24 | C88.2 88.93,42.75 88.24,42.06 88.24,41.25 88.19,41.2 IC20.1 | v118.39,68.62 114.31,72.69 102.3,72.69 | R123.1 93.07,70.34 95.43,72.69 102.3,72.69 | Q13.B 102.28,72.67 102.3,72.69 | C95.2 118.45,66.57 v118.39,66.51 | IC12.5 50.88,62.99 51.28,62.59 51.91,62.59 C67.1
  Top 0.406: R85.2 14.6,65.15 36.51,65.15 v36.58,65.22 | v120.84,15.75 120.86,15.72 C41.2 120.89,14.95 IC7.16 | v107.31,15.75 107.31,14.96 C34.2 108.75,14.92 IC3.16 | IC7.10 v129.92,13.84 | C88.2 90.55,42.75 C87.1 91.62,43.03 92.35,43.76 v92.35,45.74 | C67.1 51.83,62.6 51.63,62.8 51.63,63.45 v51.59,63.49 | v126.39,25.48 C94.1 124.36,25.33 C93.2 123.33,24.3
  Top 0.61: 132.08,26.23 C37.1 131.24,26.5 IC5.5 | v32.7,86.49 C78.2
  Top 1.016: v132.27,28.19 v132.27,27.43 132.27,26.99 C37.1
  L3 0.406: 76.16,45.74 76.07,45.66 v76.07,41.24 76.09,41.22 v76.09,37.85
  L3 1.27: 133.22,38.06 133.27,38.11 133.27,41.95 129.48,45.74 v118.39,45.74 v110.66,45.74 v92.35,45.74 76.16,45.74 51.42,45.74 v51.41,45.73 51.4,45.74 v36.58,45.74
  Bottom 0.254: v110.66,55.45 v110.66,50.13 v110.66,45.74
  Bottom 0.406: v51.59,63.49 51.59,61.66 50.32,60.39 50.32,46.83 v51.41,45.73
  Bottom 0.61: v118.39,45.74 v118.39,55.33 v118.39,66.51 v118.39,68.62
  Bottom 0.813: v32.7,86.49 34.38,86.49 36.58,84.29 v36.58,65.22 v36.58,45.74
  pour L3 (isolate 0.254): 106.74,39.24 133.79,39.24 135.25,38.8 135.25,12.89 134.75,12.38 109.09,12.38 105.98,15.49 105.98,38.48
+3V3_DIB  (via drill 0.4)
  Top 0.254: R24.1 R25.1 R26.1 v102.93,8.51 | OK1.4 v134.96,8.17
  Top 0.406: v90.68,9.08 C43.2 91.31,9.82 91.85,9.28 IC8.8 | IC3.1 108.75,9.59 C33.1 107.12,9.56 v107.12,8.89 | IC7.1 122.28,9.59 C40.1 120.84,9.56 v120.84,8.89
  pour L3: 53.34,4.13 53.34,12.57 54.1,13.34 104.65,13.34 107.76,10.22 135.42,10.22 135.89,9.75 135.89,3.43 54.04,3.43
+5V  (via drill 0.4)
  Top 0.203: IC5.3 129.36,30.15 129.6,29.91 131,29.91 131.25,30.16 131.25,31.01 IC5.1
  Top 0.406: K1.1 24.78,58.17 24.78,56.96 24.71,56.9 26.55,56.9 D17.C | D17.C 27.19,56.45 | Q29.2 v52.69,21.22 | Q30.2 52.7,17.6 v52.69,17.61 | v70.18,38.01 70.18,32.94 v71.65,31.47 | v27.13,57.15 27.13,56.32 D17.C
  Top 0.508: IC5.1 131.24,32.5 C38.2
  Top 0.813: C38.2 134.58,35.84 v134.58,39.6 134.98,39.2 FB2.P$2
  L3 0.406: v52.69,17.61 v52.69,21.22 67.75,21.22 71.65,25.12 v71.65,31.47
  L3 0.61: 119.6,47.07 119.57,47.04
  L3 0.813: LED2.BA LED2.TA 10.16,76.58 10.16,72.71 | 10.16,72.71 10.16,53.84 12.99,51 25.25,51 25.25,50.99 v27.19,49.05 28.08,48.16 36.55,48.16 37.67,47.04 v69.72,47.04 119.57,47.04 130.05,47.04 134.58,42.51 v134.58,39.6 | LED1.TA 10.1,72.77 10.16,72.71
  Bottom 0.406: v69.72,47.04 69.7,47.04 69.39,46.74 69.39,38.8 v70.18,38.01 | v27.13,57.15 27.13,49.11 v27.19,49.05
+5VOUT  (via drill 0.4)
  Top 0.254: v138.88,42.99 138.89,43 TP2.1
  Top 0.61: IC4.1 143.73,41.27 C36.1
  Top 0.813: C36.1 141.77,41.11 D6.C 140.47,41.4 v138.88,42.99 FB1.P$1 | v138.88,39.2 FB2.P$1
  Bottom 0.813: v138.88,42.99 v138.88,39.2
+VNR  (via drill 0.4)
  Top 0.61: C30.1 143.3,28.47 143.29,28.47 | R15.1 143.29,28.47 | v151.07,41.91 151.07,41.3 IC4.8 | 143.29,28.47 143.26,28.51 143.26,29.21 v143.51,29.46 | D2.A v146.81,45.15
  L3 0.406: 151.07,37.02 162.07,37.02 X2.1
  L3 0.61: 147.99,33.94 148.46,34.42 148.46,43.5 v146.81,45.15
  L3 0.813: v143.51,29.46 147.99,33.94 151.07,37.02 v151.07,41.91
+VREF  (via drill 0.4)  (1 unrouted)
  Top 0.254: 100.5,44.93 100.24,45.19 100.18,45.25 | 111.12,33.4 C99.2 | 111.06,33.34 C99.2 | C99.2 111.31,33.59 114.49,33.59 114.92,33.16 IC22.25 116.6,33.16 118.33,31.43 122.57,31.43 122.8,31.66 IC22.9
  Top 0.305: 100.43,45 100.43,45.18 100.43,45.44 100.5,44.93 100.43,45 | 100.43,45 100.37,45 100.18,44.81 | 100.32,45.4 95.25,45.4 91.68,41.83 90,41.83 88.73,40.56 IC20.2 86.56,40.56 86.28,40.84 86.28,43.09 v86.42,43.2 86.91,42.75 C89.2 | 85.33,43.22 v86.41,43.22
  Top 0.406: 100.43,45.18 C91.+ 100.24,45.44 100.24,45.19 100.24,42.46 99.92,42.14 IC21.6 | C99.2 111.19,33.47 110.06,33.47 105.19,38.33 102.06,38.33 101.14,39.24 101.14,44.9 100.53,44.9 100.5,44.93 100.32,45.11 100.32,45.4 | v59.54,52.11 59.55,57.81 R30.1
  L3 0.305: v77.2,43.2 v86.42,43.2
  L3 0.406: v77.19,48.35 63.3,48.35 v59.54,52.11
  Bottom 0.406: v77.2,43.2 v77.2,48.34 v77.19,48.35
  pour Top (no thermals): 84.29,43.61 85.72,43.61 85.72,42.37 84.29,42.37
-9V  (via drill 0.4)
  Top 0.254: R41.2 91.29,68.08 v91.33,68.11
  Top 0.305: 147.93,25.65 R13.1
  Top 0.406: IC6.3 145.54,32.76 v145.54,33.4 | R44.2 R41.2
  Top 0.61: C24.1 v146.81,25.65 147.93,25.65
  L3 0.508: v145.54,33.4 145.54,42.35 125.05,62.85 96.59,62.85 v91.33,68.11
  L3 0.813: v147.96,31.62 147.96,26.8 v146.81,25.65
  pour Top (isolate 0.254): 145.03,31.31 145.03,35.5 151.76,35.5 151.76,31.31
AGND  (via drill 0.4)
  Top 0.254: v157.1,80.7 157.36,80.45 IC1.6 157.36,79.05 SH2.1
  Top 0.406: C21.2 R9.1 163.76,80.77 | R3.1 163.76,80.77 | C21.2 163.76,83.95 | v163.39,81.22 163.76,80.77 | 153.35,84.2 R12.2 153.35,84.58 154.24,85.47 162.81,85.47 163.76,84.52 C21.2
  Bottom 0.406: v163.39,81.22 157.62,81.22 v157.1,80.7
AUX_IN+
  Top 0.254: C80.2 R93.2 22.29,75.06 IC16.3 19.05,69.9 ZD5.3
  Top 0.406: R94.1 18.78,69.15 ZD5.3
AUX_IN-
  Top 0.254: ZD5.2 21.87,67.23 | 21.87,67.23 C81.2 | 21.87,67.23 22.23,67.59 R99.2 22.23,70.69 IC16.4
  Top 0.406: R98.1 18.06,67.18 ZD5.1 ZD5.2
AUX_ISET_SW  (via drill 0.4)
  Top 0.254: IC13.6 33.15,83.72 34.87,82 v35.5,82 35.15,82 | IC22.45 120.88,27.41 v120.6,27.69
  L3 0.254: v67.41,34 67.12,33.71 64.36,33.71 61.52,36.55 35.93,36.55 v35.5,36.98
  Bottom 0.254: v120.6,27.69 120.22,28.11 119.25,29.07 119.25,29.54 118.21,30.58 115.21,30.58 113.09,32.7 110.24,32.7 109.68,33.26 69.99,33.26 69.25,34 v67.41,34 | v35.5,82 v35.5,36.98
AUX_OUT  (via drill 0.4)
  Top 0.254: R96.1 29.26,76.12 29.18,76.04 29.18,75.63 29.69,75.63 30.05,75.27 31.86,75.27 v32.12,75.02 | IC14.1 73,42.06 71.14,42.06 | 71.14,42.06 67.09,42.06 60.16,49 v60.16,49.61 | 71.14,42.06 71.22,41.99 71.22,40.32 73.04,38.51 IC17.1
  L3 0.254: v60.16,49.61 60.06,49.61 58.97,50.7 34.01,50.7 33.21,51.5 32.3,51.5 v32.14,51.65
  Bottom 0.254: v32.12,75.02 32.4,74.74 32.42,51.93 v32.14,51.65
AUX_USET_SW  (via drill 0.4)
  Top 0.254: IC13.1 31.86,79.68 32.51,79.02 34.29,79.02 v34.39,78.92 | IC22.46 v121.39,28.4
  L3 0.254: v66.52,34.56 66.18,34.21 64.58,34.21 61.73,37.06 36.55,37.06 35.8,37.81 v34.7,37.81
  Bottom 0.254: v66.52,34.56 66.75,34.78 69.19,34.78 70.21,33.77 109.89,33.77 110.45,33.21 113.31,33.21 115.43,31.09 118.43,31.09 119.77,29.74 119.77,29.27 120.45,28.6 121.2,28.6 v121.39,28.41 v121.39,28.4 | v34.39,78.92 34.48,78.92 34.99,78.41 34.99,38.1 v34.7,37.81
BOOT0  (via drill 0.4)
  Top 0.254: IC7.13 126.11,15.62 123.81,17.92 123.81,18.92 122.63,20.1 v121.86,20.1 | R122.2 120.71,23.81 | 120.71,23.81 120.27,23.81 v120.14,23.69 | IC22.44 120.4,25.32 120.78,24.94 120.78,23.87 120.71,23.81
  L3 0.254: v121.86,20.1 121.86,21.97 v120.14,23.69
CC_ACTIVE  (via drill 0.4)
  Top 0.254: IC22.2 124.87,28.16 v125.28,27.74 | R113.1 R115.2 117.28,53.49 127.32,43.46 v127.32,42.44
  Bottom 0.254: v125.28,27.74 125.36,27.74 126.61,28.98 126.61,41.73 v127.32,42.44
CC_LED
  Top 0.305: R121.2 9.59,80.07 8,78.49 5.69,78.49 LED2.BC
CC_LED_OUT  (via drill 0.4)
  Top 0.254: v18.41,79.06 Q27.1 | IC22.35 116.32,28.16 v116.8,28.64
  L3 0.254: v110.76,29.97 115.47,29.97 v116.8,28.64 | v68.22,32.41 67.94,32.69 63.93,32.69 61.09,35.53 34.68,35.53 24.94,45.28 v24.94,47.83
  Bottom 0.254: v68.22,32.41 68.39,32.24 108.48,32.24 v110.76,29.97 | v24.94,47.83 24.94,48.78 25.27,49.11 25.27,61.82 18.97,68.12 18.97,75.03 18.59,75.41 18.59,78.88 v18.41,79.06
CURR_HI  (via drill 0.4)
  Top 0.254: IC22.4 122.56,29.17 v122.34,28.96 | IC12.6 49.66,63.65 v48.82,64.49 | v65.73,35.34 65.73,35.55 65.81,35.62 65.81,36.45 65.51,36.75 65.51,40.06 63.56,42 50.46,42 49.94,42.52 v48.84,42.52
  Top 0.305: R71.2 48.53,90.88 v48.13,90.86 48.13,89.49 47.54,88.9 Q15.4
  L3 0.254: v48.81,80.68 v48.82,80.69 48.82,90.16 v48.13,90.86
  Bottom 0.254: v48.81,80.68 v48.81,64.5 v48.82,64.49 49.11,64.2 49.11,42.79 v48.84,42.52 | v65.73,35.34 69.36,35.34 70.42,34.28 110.11,34.28 110.67,33.72 113.53,33.72 115.65,31.6 118.64,31.6 119.85,30.39 120.89,30.39 122.33,28.96 v122.34,28.96
CURR_LO  (via drill 0.4)
  Top 0.254: IC22.5 122.69,29.65 v122.34,30.01 | R70.2 48.23,83.39 v48.02,83.19 | v65,36.13 65,39.87 63.42,41.44 49.9,41.44 v49.62,41.72
  Top 0.305: Q14.4 47.96,83.12 v48.02,83.19
  Bottom 0.254: v122.34,30.01 121.98,30.01 121.09,30.9 120.07,30.9 118.86,32.11 115.86,32.11 113.74,34.23 110.88,34.23 110.33,34.78 70.64,34.78 69.57,35.85 66.34,35.85 66.06,36.13 v65,36.13 | v48.02,83.19 48.02,82.59 49.61,81.01 49.61,80.38 49.33,80.1 49.33,65.1 49.62,64.81 v49.62,41.72
CV_ACTIVE  (via drill 0.4)
  Top 0.254: IC22.3 125.23,28.66 v125.39,28.82 | v126.38,43.05 119.88,49.55 R101.1 R103.2
  Bottom 0.254: v125.39,28.82 126.1,29.53 126.1,42.77 v126.38,43.05
CV_LED_OUT  (via drill 0.4)
  Top 0.254: IC22.29 114.35,31.18 v113.92,30.75 | v19.38,75.75 Q26.1
  L3 0.254: v113.92,30.75 111.47,30.75 v111.28,30.94 | v69.13,33.01 68.92,33.2 64.15,33.2 61.3,36.04 34.9,36.04 25.79,45.15 v25.79,48.53
  Bottom 0.254: v111.28,30.94 109.46,32.75 69.38,32.75 v69.13,33.01 | v19.38,75.75 19.48,75.65 19.48,68.34 25.79,62.03 v25.79,48.53
D_CC
  Top 0.305: Q27.3 R121.1
D_CV
  Top 0.305: R120.2 13.97,78.11 Q26.3
DAC_CS  (via drill 0.4)
  Top 0.254: v92.95,38.35 92.93,38.35 92.84,38.44 92.84,39.2 92.75,39.29 92.14,39.29 IC20.5 | IC22.14 121.89,35.84 v121.74,35.99
  Bottom 0.254: v121.74,35.99 120.08,37.66 94.93,37.66 94.23,38.35 v92.95,38.35
DAC_MOSI  (via drill 0.4)
  Top 0.254: IC20.7 93.67,40.56 v93.69,40.55 | IC22.13 122.38,35.1 122.44,35.1 v123.29,35.95
  Bottom 0.254: v93.69,40.55 93.69,40.35 95.36,38.67 120.51,38.67 121.86,37.33 122.24,37.33 123.29,36.27 v123.29,35.95
DAC_SCLK  (via drill 0.4)
  Top 0.254: IC20.6 93.2,39.9 93.64,39.47 v93.64,39.26 | IC22.11 124.7,32.68 124.99,32.97 124.99,34.11 v124.02,35.09
  Bottom 0.254: v93.64,39.26 94.06,39.26 95.15,38.16 120.29,38.16 121.64,36.82 122.02,36.82 122.5,36.34 122.5,35.55 122.96,35.09 v124.02,35.09
DC+
  Top 0.305: R1.2 163.91,9.27
  Top 0.61: R1.2 165.16,9.27
  Top 0.813: C1.2 166.94,14.03 166.18,14.8
  Top 2.54: X1.1 163.91,7 163.91,7.68 163.91,9.27 163.91,12.53 166.18,14.8 170.9,19.51 L1.1
DC-  (via drill 0.4)
  Top 0.61: R1.1 159.12,6.29 X1.2
  Top 0.813: C1.1 v170.75,15.24
  Bottom 0.813: v170.75,15.24 170.69,15.24 169.23,16.7
  Bottom 2.54: X1.2 159.91,7.38 169.23,16.7 171.06,18.54 171.06,23.72 L1.3
DC_BIAS  (via drill 0.4)
  Top 0.305: R39.2 99.65,61.44 99.02,61.44 98.45,62.01 98.45,65.32 | R38.2 98.53,65.39 98.45,65.32 | 98.45,65.32 98.45,71.28 v98.2,71.54
  Top 0.406: 120.24,91.19 Q7.4 | 99.72,61.38 R39.2
  L3 0.305: v122.06,82.61 119.22,79.77 106.43,79.77 v98.2,71.54
  pour Top: 112.64,95.16 129.53,95.16 129.97,94.72 129.97,82.91 129.43,82.36 121.35,82.36 121.08,82.63 121.08,86.35 120.71,86.72 112.89,86.72 112.64,86.97
DC_OUT  (via drill 0.4)
  Top 0.254: IC2.2 151.51,7.18 151.64,7.05 | C9.2 v161.86,77.41 161.81,77.36 161.47,77.36
  Top 0.305: IC1.20 161.47,77.36 | v132.47,82.26 132.47,83.55 R36.1
  Top 0.406: v151.26,69.22 149.73,69.22 146.7,72.25 v132.49,72.25
  Top 0.813: C3.2 172.79,36.26 172.72,36.2
  Top 2.54: L1.2 161.85,21.71 172.72,32.58 172.72,36.2 172.72,36.58 172.59,36.7
  L3 1.27: v149.54,5.08 150.62,5.08 161.85,16.31 L1.2
  Bottom 0.305: v161.86,77.41 161.86,76.52 158.69,73.34 | 132.49,82.25 v132.47,82.26
  Bottom 0.406: v132.49,72.25 132.49,82.25
  other vias: 152.08,68.39 152.08,67.56 152.08,66.74 152.08,65.91 152.08,65.09 152.08,64.26 151.26,67.56 151.26,66.74 151.26,65.91 151.26,65.09 151.26,64.26 155.51,62.99 155.51,62.23 154.31,60.83 154.31,60.01 154.31,59.18 154.31,58.36 154.31,57.53 154.31,56.71 154.31,55.88 154.31,55.05 154.31,54.23 155.38,48.7 154.5,48.7 155.38,46.55 154.5,46.55 151.26,68.39 152.08,63.44 151.26,63.44 152.08,69.22 154.31,53.4 154.31,52.58
  pour Top (isolate 0.305, no thermals): 151.07,9.46 151.83,9.46 151.83,3.17 151.51,2.86 147.76,2.86 147.51,3.11 147.51,7.68 151.07,7.68
  pour Top (isolate 0.305, no thermals): 156.27,47.88 158.69,45.47 171.83,45.47 174.69,42.61 174.69,34.92 174.31,34.54 170.5,34.54 170.31,34.73 170.31,39.5 168.72,41.08 155.13,41.08 150.3,45.91 150.3,69.47 150.69,69.85 157.73,69.85 157.73,64.26 156.27,62.8
  pour Bottom (isolate 0.305, rank 2): 158.75,73.6 159.45,72.9 159.45,46.48 158.43,45.47 149.61,45.47 148.84,46.23 148.84,72.01 150.43,73.6
  pour L3 (isolate 0.305, rank 2): 158.75,73.6 159.45,72.9 159.45,46.48 158.43,45.47 149.61,45.47 148.84,46.23 148.84,72.01 150.43,73.6
DIB_A0  (via drill 0.4)
  Top 0.203: R26.2 100.85,9.28 IC8.1
  Top 0.254: X4.17 76.04,8.76 80.95,8.76 v81.23,9.04 | v94.68,9.08 94.87,9.28 IC8.1
  L3 0.254: v94.68,9.08 93.6,8 82.27,8 v81.23,9.04
DIB_A1  (via drill 0.4)
  Top 0.203: 100.66,11.05 100.15,10.55 IC8.2
  Top 0.254: 100.66,11.05 R25.2 | v95.44,11.06 95.96,10.55 IC8.2
  Bottom 0.203: X4.19 78.43,11.02 92.6,11.02 93.46,11.87 94.63,11.87 v95.44,11.06
DIB_A2  (via drill 0.4)
  Top 0.203: R24.2 99.45,11.82 IC8.3 96.25,11.82 v95.75,12.32
  L3 0.203: X4.18 75.95,13.61 92.22,13.61 93.5,12.33 95.73,12.33 v95.75,12.32
DIB_BOOT0  (via drill 0.4)
  Top 0.254: v86.49,4.25 87.63,3.11 124.71,3.11 v129.92,8.32 IC7.7 | IC7.4 v126.11,8.32 | v86.3,9.02 86.3,11.2 X4.26
  Bottom 0.254: v129.92,8.32 v126.11,8.32 | v86.49,4.25 86.49,8.83 v86.3,9.02
DIB_CSA  (via drill 0.4)
  Top 0.254: IC3.5 113.86,8.76 111.25,6.16 101.79,6.16 101.22,6.73 70.83,6.73 70.26,6.16 69.22,6.16 68.49,6.88 v64.68,6.88
  L3 0.254: v64.68,6.88 X4.9
DIB_CSB
  Top 0.254: DIB1.1.NO 67.88,13.16 X4.12
DIB_FAULT
  Top 0.254: OK1.3 133.69,7.19 R28.2 133.3,6.4 132.52,5.63 128.8,5.63 125.83,2.65 64.37,2.65 X4.3
DIB_IRQ
  Top 0.254: DIB1.1.NC 64.08,13.1 X4.10
DIB_MISO  (via drill 0.4)
  Top 0.254: IC3.6 115.13,8.64 112.14,5.65 101.6,5.65 101.03,6.22 71.46,6.22 v71.12,5.88
  L3 0.254: v71.12,5.88 71.03,5.97 71.03,11.23 X4.14
DIB_MOSI  (via drill 0.4)
  Top 0.254: IC7.3 124.84,7.49 121.98,4.64 101.22,4.64 100.65,5.21 74.6,5.21 v74.33,4.94
  L3 0.254: X4.15 72.3,6.97 v74.33,4.94
DIB_NRESET  (via drill 0.4)
  Top 0.254: 110.05,9.34 IC3.2 110.05,8.51 109.22,7.68 102.36,7.68 101.79,8.26 63.68,8.27 v63.39,8.56
  Bottom 0.254: X4.4 58.33,11.23 58.33,9.23 59.31,8.26 63.08,8.26 v63.39,8.56
DIB_SCL  (via drill 0.4)
  Top 0.254: IC8.6 91.94,11.82 v91.92,11.84
  Bottom 0.203: X4.5 61.07,11.43 91.52,11.43 v91.92,11.84
DIB_SCLK  (via drill 0.4)
  Top 0.254: IC3.4 112.58,8.7 110.55,6.67 101.98,6.67 101.41,7.24 70.04,7.24 v69.76,6.96
  L3 0.254: v69.76,6.96 X4.13
DIB_SDA  (via drill 0.4)  (1 unrouted)
  Top 0.203: IC8.5 92.99,13.06 v94.12,13.06
  L3 0.203: v94.12,13.06 93.14,14.03 63.63,14.03 62.14,12.55
DIB_SYNC
  Top 0.254: IC3.3 111.32,8.57 109.92,7.18 102.17,7.18 101.6,7.75 62.2,7.75 60.88,9.07 60.88,11.22 X4.6
DIB_UART_RX  (via drill 0.4)
  Top 0.254: IC7.6 128.65,8.26 124.02,3.62 89.15,3.62 v88.33,4.45
  Bottom 0.254: X4.27 87.54,5.23 v88.33,4.45
DIB_UART_TX  (via drill 0.4)
  Top 0.254: IC7.5 127.38,8.38 123.13,4.13 89.72,4.13 v89.41,4.45 | v89.41,9.04 89.41,10.63 X4.28
  Bottom 0.254: v89.41,4.45 v89.41,9.04
DP_LED
  Top 0.254: Q28.3 90.77,65.63 R125.2
EN_ULVO  (via drill 0.4)
  Top 0.254: IC1.1 159.88,78.86 v160.53,79.5 161.1,79.5 R3.2 | D1.C v145.5,68.05
  L3 0.254: 145.8,68.07 145.8,48.64 156.67,37.77 X2.2 | 145.8,68.07 145.8,76.33 148.97,79.5 v160.53,79.5 | v145.5,68.05 145.77,68.05 145.8,68.07
FB
  Top 0.254: 157.23,82.17 C20.1 | IC1.5 157.86,81.54 C20.1 | C22.1 144.56,83.14 Q3.C 148.4,85.92 148.84,85.47 148.84,82.74 149.41,82.17 153.35,82.17 R12.1 R6.2 C20.1
GCOM  (via drill 0.4)
  Top 0.254: R65.1 v50.83,79.82 50.81,79.83
  Top 0.406: IC10.7 58.36,62.62 v57.73,63.25 57.09,62.6 IC10.6
  Top 0.61: R93.1 C80.1 24.25,76.96 25.11,76.96 v25.12,76.95 | R42.1 v79.79,51.44
  L3 0.61: v25.12,76.95 25.88,77.71 50.6,77.71 51.02,78.14 | v50.83,79.82 50.83,78.33 51.02,78.14 | 51.02,78.14 51.04,78.12 53.12,78.12 56.19,75.06 56.19,64.8 v57.73,63.25 | v57.73,54.62 76.61,54.62 v79.79,51.44
  Bottom 0.61: v57.73,63.25 v57.73,54.62
GND  (via drill 0.4)  (1 unrouted)
  Top 0.203: IC23.4 123.91,69.63 v123.95,69.6
  Top 0.254: IC20.8 92.04,41.25 92.8,41.25 v93.19,41.64 | C42.1 v143.7,32.26 | 152.91,4.51 R17.1 | 151.51,11.49 v151.64,11.37 | IC2.9 151.51,16.03 C32.1 C35.1 | v142.56,18.29 142.94,19.03 TR1.4 | v146.05,27.3 146.05,28.07 C24.2 | C30.2 143.32,26.42 v142.94,26.8 | IC6.5 v149.99,31.49 v149.99,31.5 | R97.1 v31.06,56.96 | Q20.2 v29.6,50.8 | Q25.2 v77.1,23.3 | v79.74,23.37 IC19.4 | R107.2 v85.71,30.61 | C54.1 51.83,76.77 v51.83,77.09 v51.82,77.09 | C102.1 v122.36,42.06 | C103.1 v118.36,42.06 | v120.14,21.91 R122.1 | C105.1 v110.55,42.06 | v130.37,24.57 C39.1 | C37.2 131.51,24.19 v131.13,24.57 | v130.3,32.07 IC5.2 | v114.48,42.08 C104.1 | IC22.47 121.89,27.34 v122.17,27.62 | C97.1 114.15,35.41 v114.19,35.55 114.05,35.31 C98.1 113.1,35.37 | R127.2 v128.04,37.47 C100.1 | 111.51,35.43 111.44,35.37 C99.1 111.19,35.37 | v72.02,41.24 IC14.2 | C77.2 19.27,83.67 v19.25,83.69 | C78.1 v28.9,86.49 | C76.2 v28.82,69.83 | v30.92,78.7 D20.A | IC13.4 34.33,80.42 v34.36,80.45 | C96.2 v127.96,33.27 v127.97,33.27 | IC22.8 125.07,31.18 v125.31,31.42 | IC22.23 117.37,35.55 v116.84,36.08 | R100.1 v84.85,22.19 | C45.2 123.9,83.5 v123.59,84.01 | C95.1 v122.21,65.89 | R71.1 51.74,90.88 v51.74,90.87 | R70.1 50.91,84.31 v50.93,84.33 | C64.1 v88.63,56.17 | C101.1 v124.05,37.88 | C61.2 61.57,68.39 v61.56,68.4 | IC12.2 v47.02,62.99 | Q26.2 17.46,77.34 v17.44,77.32 | IC17.2 72.16,37.85 v71.95,38.05 | C85.1 v106.82,56.6 | Q16.E 31.11,62.09 v31.52,62.5 | v12.59,32.83 R128.2 | R27.1 131.55,19.46 v132.57,19.46
  Top 0.279: IC2.9 151.51,11.49
  Top 0.305: Q27.2 v18.48,81.09 | IC15.4 v25.72,81.09 | R92.1 12.63,75.24 v12.58,75.18 | v79.03,42.32 79.57,42.32 C51.2
  Top 0.406: C87.2 v89.85,44.46 | C88.1 v88.12,44.45 | IC21.4 102.02,43.41 | C92.2 v96.18,40.36 | D22.C v59.99,19.14 | 153.48,10.22 R20.1 155.96,10.22 156.4,9.78 156.4,5.21 155.89,4.7 155.32,4.7 C31.2 154.88,4.7 153.03,4.7 R17.1 | v149.86,26.8 149.86,26.03 C23.2 | v141.67,32.64 D7.C | C82.1 v84.52,26.2 | R119.1 v77.88,27.75 | v67.16,23.13 R112.1 R111.1 | R51.1 v113.67,84.32 v113.67,84.33 v113.67,84.34 C47.2 | R48.1 v110.68,85.22 R49.1 | Q19.E 17.29,64.18 v17.28,64.2 | R78.1 v28.32,63.5 v28.33,63.5 | v21.72,60.64 21.72,61.34 R87.1 | v119.19,15.68 119.19,14.95 C41.1 | v105.6,15.68 105.6,14.95 C34.1 | IC7.15 v123.57,15.94 | v131.83,14.92 131.22,14.92 IC7.9 | IC3.9 v117.67,15.94 | C89.1 86.42,44.45 v86.41,44.44 | Q24.E v73.87,27.54 v73.88,27.53 | C83.1 106.23,49.61 v106.24,49.61 | C56.1 84.5,48.83 v84.58,48.91 | C57.1 62.98,62.69 v63,62.7 | C44.2 56.03,58.01 56.05,57.99 56.72,57.99 | 56.72,57.99 57.74,57.99 R34.2 | R34.2 | v56.78,57.12 56.78,57.93 56.72,57.99 | C65.1 54.05,65.04 v54.02,65.01 | C94.2 v125.16,21.5 | C93.1 123.91,22.39 v123.97,22.34 | v112.05,35.48 111.41,35.48 C99.1
  Top 0.508: v51.82,77.09 51.82,77.5 C55.2 | C59.1 51.83,75.12 v51.76,75.18 | C62.1 v64.53,84.65 v64.52,84.64 C60.1 | v62.55,84.2 62.52,84.2 C63.2
  Top 0.61: D6.A v141.67,38.67 | v130.3,32.07 130.3,32.96 C38.1 | C67.2 v53.61,63.32 | C79.2 v28.81,72.34
  Bottom 1.27: SH1.2 147.07,80.96
  other vias: 106.45,44.37 103.95,44.41 103.15,44.41 149.61,38.73 149.22,31.5 147.19,39.94 152.4,11.37 152.4,10.6 151.64,10.6 143.7,26.8 141.8,18.29 145.29,27.3 150.62,26.8 143.32,18.29 149.61,37.53 147.19,38.73 147.19,41.08 149.61,41.08 149.61,39.94 147.19,37.59 147.96,81.03 147.96,82.64 147.96,81.83 147.96,80.21 123.59,83.21 131.89,24.57 101.97,41.24 37.89,71.16 37.9,55.75 37.93,51.88 37.71,38.21 81.18,36.82
  pour Top (isolate 0.203): 94.84,44.81 108.18,44.81 108.18,38.96 94.84,38.96
  pour Bottom (isolate 0.254, rank 2): 13.97,84.52 21.78,84.52 32.26,95 130.35,95.19 131.11,95.19 131.11,85.92 134.82,85.92 134.82,94.98 148.08,94.98 148.08,45.85 152.91,41.02 152.91,28.57 157.16,24.32 157.16,1.91 156.4,1.14 138.37,1.14 137.67,1.84 137.67,11.3 136.78,12.19 108.78,12.19 105.73,15.24 41.25,15.24 30.81,25.68 30.81,39.76 27.05,43.52 12.85,43.52 11.16,45.21 11.14,55.23 11.14,81.71
  pour Top (isolate 0.254): 143.13,37.27 143.19,41.47 151.76,41.4 151.76,37.21
  pour Top (isolate 0.254, rank 2, no thermals): 139.45,12.89 154.81,12.89 154.81,9.4 146.88,9.4 146.49,9.02 146.49,2.86 139.95,2.86 138.87,3.94 138.87,12.32
  pour L2 (isolate 0.305, rank 3): 11.14,95.25 179.58,95.25 179.58,-0.25 137.67,-0.25 137.67,11.3 136.78,12.19 108.78,12.19 105.73,15.24 53.28,15.24 49.97,11.94 49.97,2.86 47.88,0.76 11.14,0.76
  pour Top (no thermals): 80.47,37.44 81.9,37.44 81.9,36.2 80.47,36.2
GNDIO  (via drill 0.4)
  Top 0.203: IC8.7 93.99,10.55 v94.04,10.49
  Top 0.254: IC7.8 v131.19,8.57 | IC7.2 v123.57,8.57 | C40.2 119.19,9.59 v119.19,8.83 | IC3.8 v117.67,8.57 | C33.2 105.47,9.59 v105.47,8.89 | C43.1 v90.68,12.26 | IC8.4 98.25,12.98 v97.23,12.98
  other vias: 135.48,3.86 131.95,9.84 53.91,4
  pour L2: 53.34,4.13 53.34,12.57 54.1,13.34 104.65,13.34 107.76,10.22 135.42,10.22 135.89,9.75 135.89,3.87 135.45,3.43 54.04,3.43
  pour Top: 53.34,3.24 53.34,12.57 54.1,13.34 104.65,13.34 107.76,10.22 135.42,10.22 135.89,9.75 135.89,2.98 135.45,2.54 54.04,2.54
HO  (via drill 0.4)
  Top 0.254: IC1.18 158.86,75.78 v159.32,75.25
  Top 0.406: Q1.4
  Top 0.61: Q1.4 v158.93,69.14 v158.94,69.15
  L3 0.61: v159.32,75.25 158.93,74.86 v158.93,69.16 v158.94,69.15
HOLE_DL  (via drill 3.2 pad 5.5)
  other vias: 11,5.5
HOLE_UL  (via drill 3.2 pad 5.5)
  other vias: 11,89.5
I_MON  (via drill 0.4)
  Top 0.254: 60.01,74.23 59.95,74.17 59.74,74.17 R73.2 | R73.2 R68.1 | R68.1 57.67,77.59 56.65,78.62 IC11.6 | R73.2 | R132.2 112.52,41.73 107.1,47.16 100.29,47.16 v97.46,49.99 | R68.1 57.67,73.23 v57.6,73.15 | v50.41,61.92 50.41,62.04 IC12.4
  L3 0.254: 59.3,61.63 50.7,61.63 v50.41,61.92 | v57.6,73.15 59.3,71.46 59.3,61.63 | 59.3,61.63 69.55,61.63 v69.88,61.96
  Bottom 0.254: v97.46,49.99 97.43,49.96 91.76,49.96 81.71,60.01 71.83,60.01 v69.88,61.96
I_MON_AIN
  Top 0.254: C105.2 R132.1 113.6,38.23 115.76,38.23 117.88,36.11 IC22.22
I_SERVO  (via drill 0.4)
  Top 0.254: R114.1 99.01,53.48 95.92,56.57 D14.C 92.04,59.96 73.1,59.96 69.52,63.54 69.52,68.34 68.61,69.25 59.63,69.25 | v58.36,69.32 58.37,69.3 D16.A 59.63,69.25 | v53.2,69.32 52.24,69.32 C66.2 | IC10.1 59.63,69.25
  Bottom 0.254: v58.36,69.32 v53.2,69.32
I_SET  (via drill 0.4)
  Top 0.254: ISET.2 v82.13,38.73 78.65,38.73 75.93,36.02 73.97,36.02 73.18,36.8 IC17.3 71.37,37.19 71.01,37.55 71.01,38.51 68.47,41.05 66.66,41.05 59.5,48.21 v58.51,48.21 | R130.2 120.5,41.31 v120.5,42.58 | IC15.5 v25.72,84.33
  L3 0.254: v82.13,38.73 87.58,38.73 91.8,42.95 109.08,42.95 109.53,43.4 119.72,43.4 119.74,43.41 120.5,42.65 v120.5,42.58 | v58.51,48.21 57.04,49.68 v33.17,49.68 | v27.27,80.11 27.27,82.78 v25.72,84.33
  Bottom 0.254: v33.17,49.68 33.45,49.96 33.45,77.31 30.64,80.11 v27.27,80.11
I_SET_AIN
  Top 0.254: 120.4,39.24 R130.1 C103.2 118.87,38.86 IC22.20
I_SET_OUT  (via drill 0.4)
  Top 0.254: v68.25,67.44 67.42,67.44 R64.1 | IC17.4 75.06,36.83 v75.08,36.8
  Bottom 0.254: v68.25,67.44 68.25,54.51 75.08,47.68 v75.08,36.8
IRQ  (via drill 0.4)
  Top 0.254: IC3.10 116.39,16.13 116.14,16.38 v116.14,19.14 | IC22.33 v113.93,29.17
  Bottom 0.254: v116.14,19.14 116.14,25.18 113.93,27.39 v113.93,29.17
ISENSE+
  Top 0.254: IC11.3 59.81,78.62 56.64,81.79 R66.2 55.87,81.62 54.06,79.82 R65.2
ISENSE-  (via drill 0.4)